# EAGLE design Arduino-M0-Mod4 (EAGLE 7.5.0)

## Sheet 1 of 2
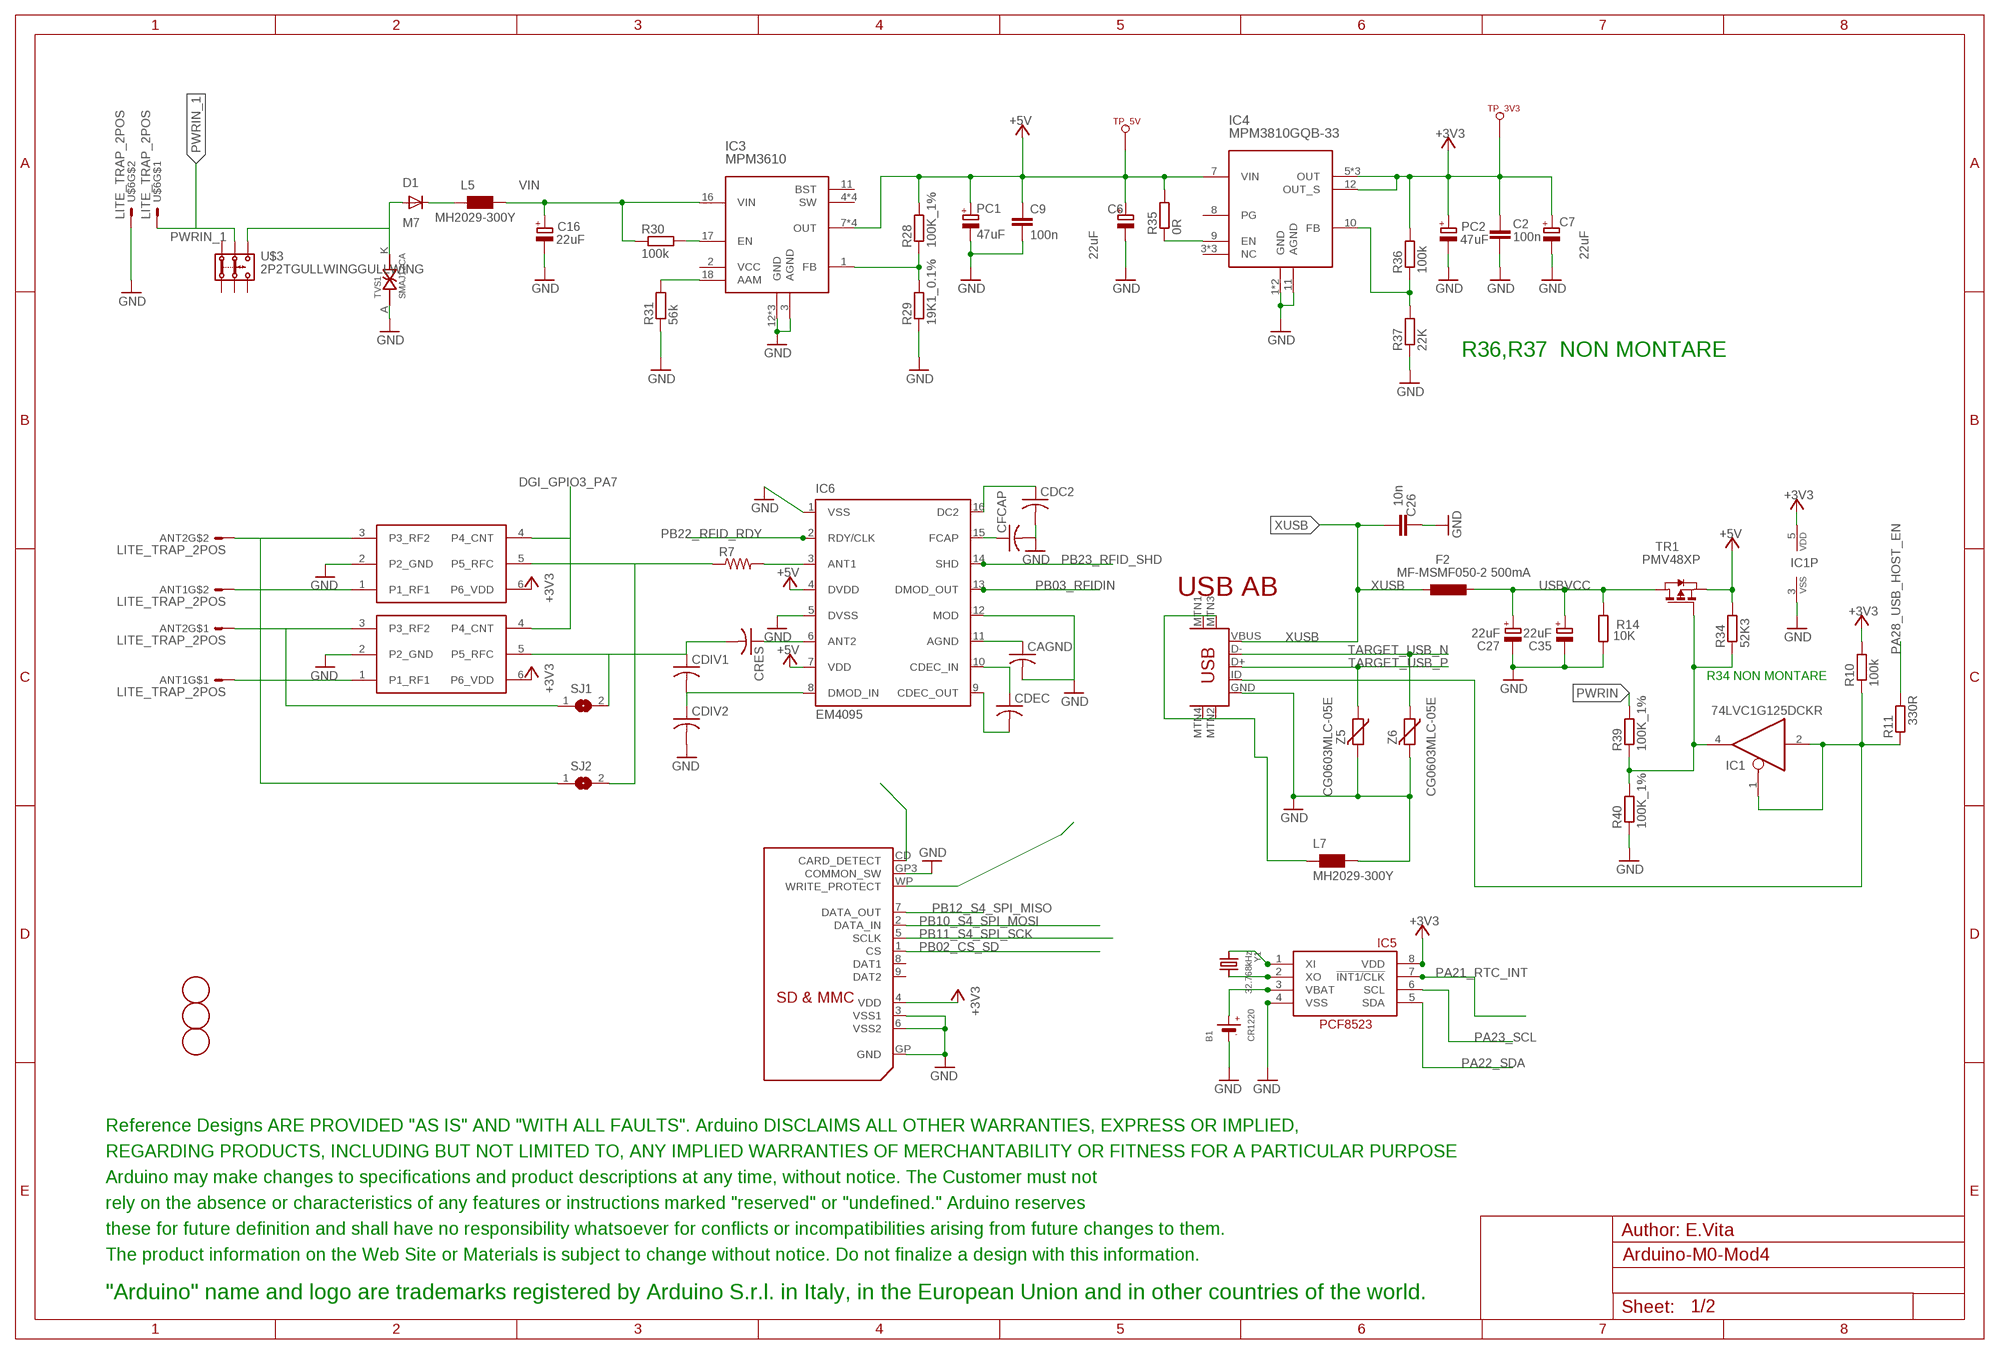
[diagram p0: schematic, sheet 1]

### Parts
ANT1  LITE_TRAP_2POS  [LITE_TRAP_MINI]
ANT2  LITE_TRAP_2POS  [LITE_TRAP_MINI]
B1  CR1220  BATTERYCR1220_SMT  [CR1220]
C2  100n  0015_100NF_0603  [C0603-ROUND]
C6  22uF  0167_  [SMC_B]
C7  22uF  0167_  [SMC_B]
C9  100n  0015_100NF_0603  [C0603-ROUND]
C16  22uF  0167_  [SMC_B]
C26  10n  0142_10NF_0603  [C0603-ROUND]
C27  22uF  0167_  [SMC_B]
C35  22uF  0167_  [SMC_B]
CAGND  C-US  [C0603-ROUND]
CDC2  C-US  [C0603-ROUND]
CDEC  C-US  [C0603-ROUND]
CDIV1  C-USC1206K  [C1206K]
CDIV2  C-USC1206K  [C1206K]
CFCAP  C-US  [C0603-ROUND]
CRES  C-USC1206K  [C1206K]
D1  M7  0020_M7  [SMB]
F2  MF-MSMF050-2 500mA  0002_MF-MSMF050-2  [L1812]
FD1  FIDUCIALMOUNT  [FIDUCIA-MOUNT]
FD2  FIDUCIALMOUNT  [FIDUCIA-MOUNT]
FD3  FIDUCIALMOUNT  [FIDUCIA-MOUNT]
IC1  74LVC1G125DCKR  0040_SN74LVC1G125DCKR  [SC70-5]
IC3  MPM3610  2093_MPM3610GQV-P  [QFN-20]
IC4  MPM3810GQB-33  2068_MPM3810GQB-33  [QFN-12]
IC5  RTC_PCF8523T  [SOIC8_150MIL]
IC6  EM4095  [SO16]
L5  MH2029-300Y  0001_BLM21PG300SN1D_/_MH2029-300Y  [0805]
L7  MH2029-300Y  0001_BLM21PG300SN1D_/_MH2029-300Y  [0805]
PC1  47uF  0113_47UF  [PANASONIC_D]
PC2  47uF  0113_47UF  [PANASONIC_D]
R7  R-US_R1206  [R1206]
R10  100k  0026_100K_0603  [R0603-ROUND]
R11  330R  0049_330R_0603  [R0603-ROUND]
R14  10K  0028_CR0603JW103L  [R0603-ROUND]
R28  100K_1%  2022_CR0603FW104L  [R0603-ROUND]
R29  19K1_0.1%  2339_  [R0603-ROUND]
R30  100k  0026_100K_0603  [R0603-ROUND]
R31  56k  0411_56K_0603  [R0603-ROUND]
R34  52K3  0180_52K3_0603  [R0603-ROUND]
R35  0R  0233_0R_0603  [R0603-ROUND]
R36  100k  0026_100K_0603  [R0603-ROUND]
R37  22K  0194_  [R0603-ROUND]
R39  100K_1%  2022_CR0603FW104L  [R0603-ROUND]
R40  100K_1%  2022_CR0603FW104L  [R0603-ROUND]
SJ1  SJW  [SJW]
SJ2  SJW  [SJW]
TP_3V3  TP_SP  [TP-SP]
TP_5V  TP_SP  [TP-SP]
TR1  PMV48XP  0297_PMV48XP  [SOT-23]
TVS1  SMAJ12CA  2194_SMAJ12CA  [SMA-TVS]
U$1  DISCLAIMER-SMALL  [DISCLAIMER]
U$3  2P2TGULLWINGGULLWING  [GULL_WING]
U$4  SDMMC06132  [06132]
U$5  USB-MINIB-5PIN  [USB-MINIB]
U$6  LITE_TRAP_2POS  [LITE_TRAP_MINI]
U$7  PE4259_RF_SWITCH  [SOT363_PHILIPS]
U$8  PE4259_RF_SWITCH  [SOT363_PHILIPS]
Y1  32.768kHz  CRYSTAL8.0X3.8  [CRYSTAL_8X3.8]
Z5  CG0603MLC-05E  0010_BRNCG0603MLC-05E  [CT/CN0603]
Z6  CG0603MLC-05E  0010_BRNCG0603MLC-05E  [CT/CN0603]

### Nets
2GND [gnd]: L7.1 U$5.MTN1(MTN2) U$5.MTN2(MTN3) U$5.MTN3(MTN1) U$5.MTN4
+3V3: C2.2 C7.+ IC1.5(VDD) IC4.5(OUT) IC4.6(OUT) IC4.12(OUT_S) IC4.14(OUT) IC5.8(VDD) PC2.+ R10.2 R36.2 TP_3V3.X(TESTP) U$4.4(VDD) U$7.6(P6_VDD) U$8.6(P6_VDD) ; also sheet 2
+5V [usbvcc]: C6.+ C9.1 IC3.7(OUT) IC3.8(OUT) IC3.9(OUT) IC3.20(OUT) IC4.7(VIN) IC6.4(DVDD) IC6.7(VDD) PC1.+ R28.2 R34.2 R35.2 TP_5V.X(TESTP) TR1.2(S) ; also sheet 2
DGI_GPIO3_PA7: U$7.4(P4_CNT) U$8.4(P4_CNT) ; also sheet 2
GND [gnd]: B1.- C2.1 C6.- C7.- C9.2 C16.- C26.2 C27.- C35.- CAGND.2 CDC2.2 CDIV2.2 CFCAP.2 IC1.3(VSS) IC3.3(AGND) IC3.12(GND) IC3.13(GND) IC3.14(GND) IC4.1(GND) IC4.2(GND) IC4.11(AGND) IC5.4(VSS) IC6.1(VSS) IC6.5(DVSS) IC6.12(MOD) L7.2 PC1.- PC2.- R14.1 R29.1 R31.1 R37.1 R40.1 TVS1.A(AK) U$4.3(VSS1) U$4.6(VSS2) U$4.GP3(COMMON_SW) U$4.GP(GND) U$5.GND U$6.P$3 U$6.P$4 U$7.2(P2_GND) U$8.2(P2_GND) Z5.2 Z6.2 ; also sheet 2
N$2: IC5.2(XO) Y1.P$4
N$3: IC5.1(XI) Y1.P$1
N$4: CFCAP.1 IC6.15(FCAP)
N$5: CAGND.1 IC6.11(AGND)
N$6: IC1.4(O) R34.1 R39.1 R40.2 TR1.3(G)
N$7: IC1.1(OE) IC1.2(I) R10.1 R11.1 U$5.ID
N$8: D1.C L5.1
N$9: IC4.9(EN) R35.1
N$11: IC4.10(FB) R36.1 R37.2
N$12: CRES.1 IC6.6(ANT2)
N$13: CDIV1.2 CDIV2.1 IC6.8(DMOD_IN)
N$14: ANT2.P$3 ANT2.P$4 SJ2.1 U$7.3(P3_RF2)
N$16: CDIV1.1 CRES.2 SJ1.2 U$8.5(P5_RFC)
N$17: CDC2.1 IC6.16(DC2)
N$18: CDEC.2 IC6.9(CDEC_OUT)
N$19: CDEC.1 IC6.10(CDEC_IN)
N$20: IC6.3(ANT1) R7.2
N$21: ANT2.P$1 ANT2.P$2 SJ1.1 U$8.3(P3_RF2)
N$22: R7.1 SJ2.2 U$7.5(P5_RFC)
N$24: ANT1.P$1 ANT1.P$2 U$8.1(P1_RF1)
N$25: ANT1.P$3 ANT1.P$4 U$7.1(P1_RF1)
N$26: IC3.1(FB) R28.1 R29.2
N$28: IC3.17(EN) R30.2
N$29: IC3.18(AAM) R31.2
PA21_RTC_INT: IC5.7(!INT1/CLK) ; also sheet 2
PA22_SDA: IC5.5(SDA) ; also sheet 2
PA23_SCL: IC5.6(SCL) ; also sheet 2
PA28_USB_HOST_EN: R11.2 ; also sheet 2
PB02_CS_SD: U$4.1(CS) ; also sheet 2
PB03_RFIDIN: IC6.13(DMOD_OUT) ; also sheet 2
PB10_S4_SPI_MOSI: U$4.2(DATA_IN) ; also sheet 2
PB11_S4_SPI_SCK: U$4.5(SCLK) ; also sheet 2
PB12_S4_SPI_MISO: U$4.7(DATA_OUT) ; also sheet 2
PB22_RFID_RDY: IC6.2(RDY/CLK) ; also sheet 2
PB23_RFID_SHD: IC6.14(SHD) ; also sheet 2
PWRIN [USB]: D1.A R39.2 TVS1.K(KA) U$3.P$5(3.1) ; also sheet 2
PWRIN_1 [USB]: U$3.P$3(2.1) U$6.P$1 U$6.P$2
SD_CD: U$4.CD(CARD_DETECT)
SD_WP: U$4.WP(WRITE_PROTECT)
TARGET_USB_N [USBpair]: U$5.D- Z6.1 ; also sheet 2
TARGET_USB_P [USBpair]: U$5.D+ Z5.1 ; also sheet 2
USBVCC [usbvcc]: C27.+ C35.+ F2.1 R14.2 TR1.1(D)
VBAT1: B1.+$1(+) IC5.3(VBAT)
VIN [gnd]: C16.+ IC3.16(VIN) L5.2 R30.1
XUSB [usbvcc]: C26.1 F2.2 U$5.VBUS
Unconnected: IC3.2(VCC) IC3.4(SW) IC3.5(SW) IC3.6(SW) IC3.11(BST) IC3.19(SW) IC4.3(NC) IC4.4(NC) IC4.8(PG) IC4.13(NC) U$3.P$1(1.1) U$3.P$2(1.2) U$3.P$4(2.2) U$3.P$6(3.2) U$4.8(DAT1) U$4.9(DAT2)

### Notes on the sheet
- R36,R37  NON MONTARE
- USB AB
- R34 NON MONTARE
- Author: E.Vita

## Sheet 2 of 2
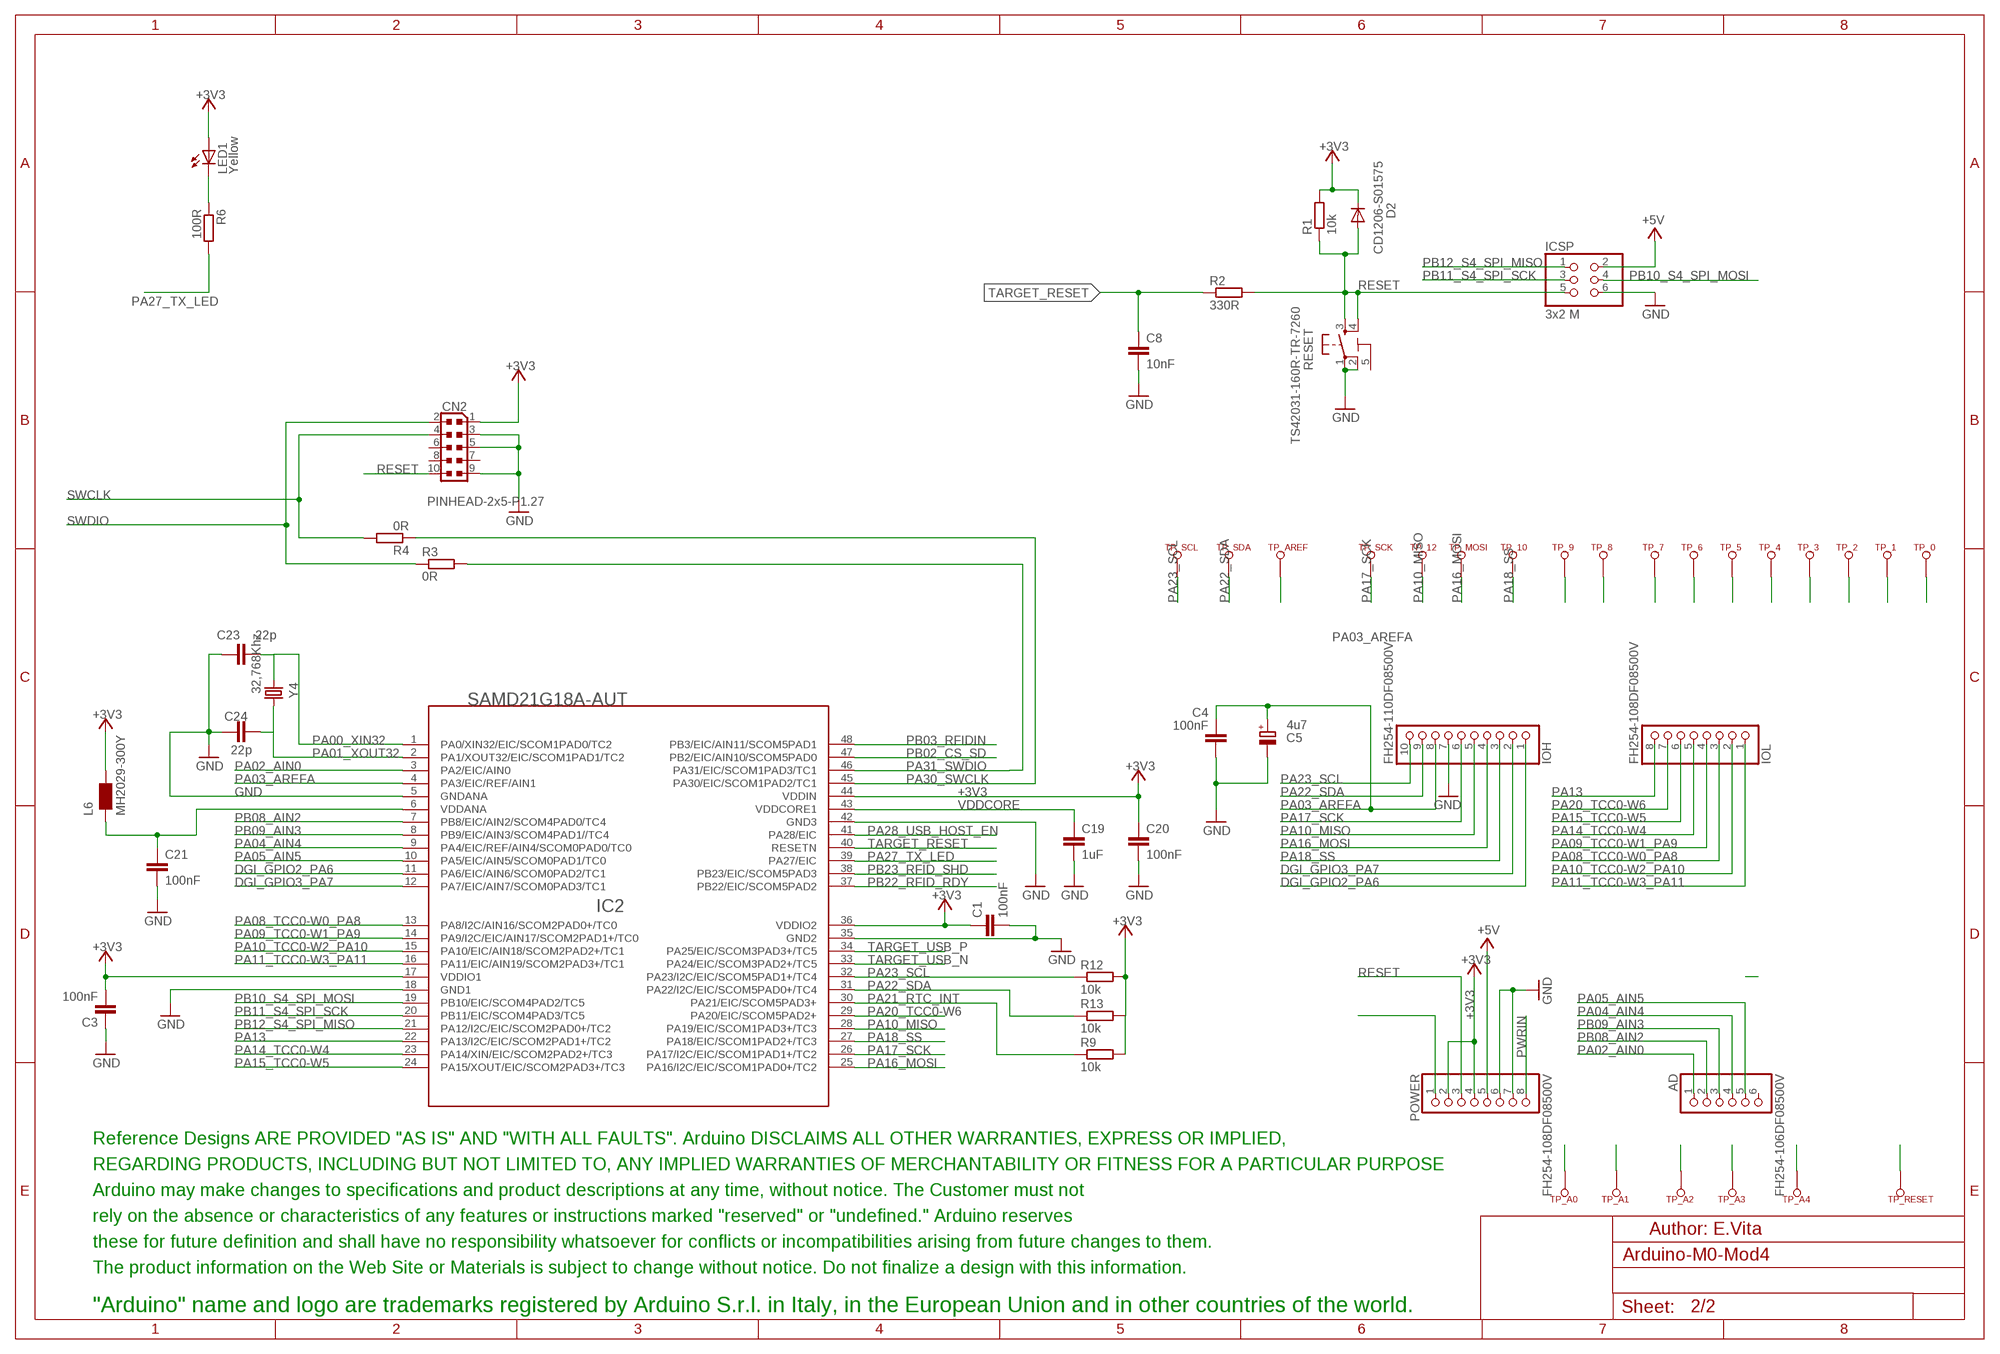
[diagram p1: schematic, sheet 2]

### Parts
AD  FH254-106DF08500V  1682_20TW-535_STD  [1X06]
C1  100nF  0015_100NF_0603  [C0603-ROUND]
C3  100nF  0015_100NF_0603  [C0603-ROUND]
C4  100nF  0015_100NF_0603  [C0603-ROUND]
C5  4u7  0474_TAJA475M016RNJ  [SMC_A]
C8  10nF  0142_10NF_0603  [C0603-ROUND]
C19  1uF  0006_1UF_0603/GRM188R61E105KA12D  [C0603-ROUND]
C20  100nF  0015_100NF_0603  [C0603-ROUND]
C21  100nF  0015_100NF_0603  [C0603-ROUND]
C23  22p  0014_22PF_0603  [C0603-ROUND]
C24  22p  0014_22PF_0603  [C0603-ROUND]
CN2  PINHEAD-2x5-P1.27  0171_PH127-205DF055G00AROUND-PADS  [PINHEAD_2X05_127]
D2  CD1206-S01575  0012_CD1206-S01575  [MINIMELF]
IC2  SAMD21G18A-AUT  1792_SAMD21G18A-AUT  [TQFP48-7X7]
ICSP  3x2 M  0114_PH254-203DF118A00V  [2X03]
IOH  FH254-110DF08500V  1684_20TW-537  [1X10]
IOL  FH254-108DF08500V  1683_20TW-536  [1X08]
L6  MH2029-300Y  0001_BLM21PG300SN1D_/_MH2029-300Y  [0805]
LED1  Yellow  0044_KPT-2012YC  [CHIPLED_0805]
POWER  FH254-108DF08500V  1683_20TW-536  [1X08]
R1  10k  0028_CR0603JW103L  [R0603-ROUND]
R2  330R  0049_330R_0603  [R0603-ROUND]
R3  0R  0233_0R_0603  [R0603-ROUND]
R4  0R  0233_0R_0603  [R0603-ROUND]
R6  100R  0233_0R_0603  [R0603-ROUND]
R9  10k  0028_CR0603JW103L  [R0603-ROUND]
R12  10k  0028_CR0603JW103L  [R0603-ROUND]
R13  10k  0028_CR0603JW103L  [R0603-ROUND]
RESET  TS42031-160R-TR-7260  0946_TS42031-160W-TR-7260  [TS42]
TP_0  TP_SP  [TP-SP]
TP_1  TP_SP  [TP-SP]
TP_2  TP_SP  [TP-SP]
TP_3  TP_SP  [TP-SP]
TP_4  TP_SP  [TP-SP]
TP_5  TP_SP  [TP-SP]
TP_6  TP_SP  [TP-SP]
TP_7  TP_SP  [TP-SP]
TP_8  TP_SP  [TP-SP]
TP_9  TP_SP  [TP-SP]
TP_10  TP_SP  [TP-SP]
TP_12  TP_SP  [TP-SP]
TP_A0  TP_SP  [TP-SP]
TP_A1  TP_SP  [TP-SP]
TP_A2  TP_SP  [TP-SP]
TP_A3  TP_SP  [TP-SP]
TP_A4  TP_SP  [TP-SP]
TP_AREF  TP_SP  [TP-SP]
TP_MOSI  TP_SP  [TP-SP]
TP_RESET  TP_SP  [TP-SP]
TP_SCK  TP_SP  [TP-SP]
TP_SCL  TP_SP  [TP-SP]
TP_SDA  TP_SP  [TP-SP]
U$2  DISCLAIMER-SMALL  [DISCLAIMER]
Y4  32,768Khz  0213_ABS07-32.768KHZ-T  [RESONATOR_EPSON_FC_145]

### Nets
+3V3: C1.1 C3.2 C20.1 CN2.1 D2.C IC2.17(VDDIO1) IC2.36(VDDIO2) IC2.44(VDDIN) L6.2 LED1.A POWER.2 POWER.4 R1.2 R9.2 R12.2 R13.2 ; also sheet 1
+5V [usbvcc]: ICSP.2 POWER.5 ; also sheet 1
DGI_GPIO1: TP_7.X(TESTP)
DGI_GPIO2_PA6: IC2.11(PA6/EIC/AIN6/SCOM0PAD2/TC1) IOH.1 TP_8.X(TESTP)
DGI_GPIO3_PA7: IC2.12(PA7/EIC/AIN7/SCOM0PAD3/TC1) IOH.2 TP_9.X(TESTP) ; also sheet 1
GND [gnd]: C1.2 C3.1 C4.2 C5.- C8.2 C19.2 C20.2 C21.2 C23.1 C24.1 CN2.3 CN2.5 CN2.9 IC2.5(GNDANA) IC2.18(GND1) IC2.35(GND2) IC2.42(GND3) ICSP.6 IOH.7 POWER.6 POWER.7 RESET.1 RESET.2 ; also sheet 1
N$1: LED1.C R6.1
N$10: C21.1 IC2.6(VDDANA) L6.1
N$56: POWER.1
PA00_XIN32: C23.2 IC2.1(PA0/XIN32/EIC/SCOM1PAD0/TC2) Y4.P$1
PA01_XOUT32: C24.2 IC2.2(PA1/XOUT32/EIC/SCOM1PAD1/TC2) Y4.P$2
PA02_AIN0: AD.1 IC2.3(PA2/EIC/AIN0) TP_A0.X(TESTP)
PA03_AREFA: C4.1 C5.+ IC2.4(PA3/EIC/REF/AIN1) IOH.8 TP_AREF.X(TESTP)
PA04_AIN4: AD.4 IC2.9(PA4/EIC/REF/AIN4/SCOM0PAD0/TC0) TP_A3.X(TESTP)
PA05_AIN5: AD.5 IC2.10(PA5/EIC/AIN5/SCOM0PAD1/TC0) TP_A4.X(TESTP)
PA08_TCC0-W0_PA8: IC2.13(PA8/I2C/AIN16/SCOM2PAD0+/TC0) IOL.3 TP_2.X(TESTP)
PA09_TCC0-W1_PA9: IC2.14(PA9/I2C/EIC/AIN17/SCOM2PAD1+/TC0) IOL.4 TP_3.X(TESTP)
PA10_MISO: IC2.28(PA19/EIC/SCOM1PAD3+/TC3) IOH.5 TP_12.X(TESTP)
PA10_TCC0-W2_PA10: IC2.15(PA10/EIC/AIN18/SCOM2PAD2+/TC1) IOL.2 TP_1.X(TESTP)
PA11_TCC0-W3_PA11: IC2.16(PA11/EIC/AIN19/SCOM2PAD3+/TC1) IOL.1 TP_0.X(TESTP)
PA13: IC2.22(PA13/I2C/EIC/SCOM2PAD1+/TC2) IOL.8
PA14_TCC0-W4: IC2.23(PA14/XIN/EIC/SCOM2PAD2+/TC3) IOL.5 TP_4.X(TESTP)
PA15_TCC0-W5: IC2.24(PA15/XOUT/EIC/SCOM2PAD3+/TC3) IOL.6 TP_5.X(TESTP)
PA16_MOSI: IC2.25(PA16/I2C/EIC/SCOM1PAD0+/TC2) IOH.4 TP_MOSI.X(TESTP)
PA17_SCK: IC2.26(PA17/I2C/EIC/SCOM1PAD1+/TC2) IOH.6 TP_SCK.X(TESTP)
PA18_SS: IC2.27(PA18/EIC/SCOM1PAD2+/TC3) IOH.3 TP_10.X(TESTP)
PA20_TCC0-W6: IC2.29(PA20/EIC/SCOM5PAD2+) IOL.7 TP_6.X(TESTP)
PA21_RTC_INT: IC2.30(PA21/EIC/SCOM5PAD3+) R9.1 ; also sheet 1
PA22_SDA: IC2.31(PA22/I2C/EIC/SCOM5PAD0+/TC4) IOH.9 R13.1 TP_SDA.X(TESTP) ; also sheet 1
PA23_SCL: IC2.32(PA23/I2C/EIC/SCOM5PAD1+/TC4) IOH.10 R12.1 TP_SCL.X(TESTP) ; also sheet 1
PA27_TX_LED: IC2.39(PA27/EIC) R6.2
PA28_USB_HOST_EN: IC2.41(PA28/EIC) ; also sheet 1
PA30_SWCLK: IC2.45(PA30/EIC/SCOM1PAD2/TC1) R4.1
PA31_SWDIO: IC2.46(PA31/EIC/SCOM1PAD3/TC1) R3.2
PB02_CS_SD: IC2.47(PB2/EIC/AIN10/SCOM5PAD0) ; also sheet 1
PB03_RFIDIN: IC2.48(PB3/EIC/AIN11/SCOM5PAD1) ; also sheet 1
PB08_AIN2: AD.2 IC2.7(PB8/EIC/AIN2/SCOM4PAD0/TC4) TP_A1.X(TESTP)
PB09_AIN3: AD.3 IC2.8(PB9/EIC/AIN3/SCOM4PAD1//TC4) TP_A2.X(TESTP)
PB10_S4_SPI_MOSI: IC2.19(PB10/EIC/SCOM4PAD2/TC5) ICSP.4 ; also sheet 1
PB11_S4_SPI_SCK: IC2.20(PB11/EIC/SCOM4PAD3/TC5) ICSP.3 ; also sheet 1
PB12_S4_SPI_MISO: IC2.21(PA12/I2C/EIC/SCOM2PAD0+/TC2) ICSP.1 ; also sheet 1
PB22_RFID_RDY: IC2.37(PB22/EIC/SCOM5PAD2) ; also sheet 1
PB23_RFID_SHD: IC2.38(PB23/EIC/SCOM5PAD3) ; also sheet 1
PWRIN [USB]: POWER.8 ; also sheet 1
RESET: CN2.10 D2.A ICSP.5 POWER.3 R1.1 R2.2 RESET.3 RESET.4 TP_RESET.X(TESTP)
SWCLK: CN2.4 R4.2
SWDIO: CN2.2 R3.1
TARGET_RESET: C8.1 IC2.40(RESETN) R2.1
TARGET_USB_N [USBpair]: IC2.33(PA24/EIC/SCOM3PAD2+/TC5) ; also sheet 1
TARGET_USB_P [USBpair]: IC2.34(PA25/EIC/SCOM3PAD3+/TC5) ; also sheet 1
VDDCORE: C19.1 IC2.43(VDDCORE1)
Unconnected: AD.6 CN2.6 CN2.7 CN2.8

### Notes on the sheet
- Author: E.Vita

## Power pins joined to a net without a drawn wire
5-GND: RESET.5(5-GND)

## Library data of the parts
AD = Connettori:1682_20TW-535: Female Gray Connector strip for Arduino 3V3 bases - 6x1 F V h 8,5 p2,54; MONTHLY_USAGE: 86722.85; PART_NUMBER: 20TW-535; PRICE: _0.03; SUPPLIER: CBC_elettronica__s.r.l.; TYPE: Connettori
ANT1 ANT2 U$6 = con-molex:LITE_TRAP_2POS
B1 = microbuilder:BATTERY: CR1220 SMT - Digikey: 3001K-ND CD2032 BAT-HLD-001 - Digikey: BAT-HLD-001-ND
C1 C3 C4 C20 C21 = Condensatori:0015_100NF_0603: 100nF 0603 50V; CASE: 0603; MONTHLY_USAGE: _____; PART_NUMBER: cl10b104kbnc; PRICE: _____; SUPPLIER: _____; TYPE: Condensatori
C2 C9 = Condensatori:0015_100NF_0603: 100nF 0603 50V; CASE: 0603; MONTHLY_USAGE: _____; PART_NUMBER: cl10b104kbnc; PRICE: _____; SUPPLIER: _____; TYPE: Condensatori; VALUE: 100nF
C5 = Condensatori:0474_TAJA475M016RNJ: 4u7 tantalio Case A - testa gialla -Tantalio; CASE: CaseA_(1206); MONTHLY_USAGE: _____; PART_NUMBER: TAJA475M016RNJ; PRICE: _____; SUPPLIER: _____; TYPE: Condensatori
C6 C7 C16 C27 C35 = Condensatori:0167_: 22uF 25V; MONTHLY_USAGE: _____; PRICE: _____; SUPPLIER: _____; TYPE: Condensatori
C8 = Condensatori:0142_10NF_0603: 10nF 0603; CASE: 0603; MONTHLY_USAGE: _____; PART_NUMBER: 10nF_0603; PRICE: _____; SUPPLIER: _____; TYPE: Condensatori
C19 = Condensatori:0006_1UF_0603/GRM188R61E105KA12D: 1uF 0603; CASE: 0603; MONTHLY_USAGE: _____; PART_NUMBER: 1uF_0603/GRM188R61E105KA12D; PRICE: _____; SUPPLIER: _____; TYPE: Condensatori
C23 C24 = Condensatori:0014_22PF_0603: 22pF 0603; CASE: 0603; MONTHLY_USAGE: _____; PART_NUMBER: 22pF_0603; PRICE: _____; SUPPLIER: _____; TYPE: Condensatori
C26 = Condensatori:0142_10NF_0603: 10nF 0603; CASE: 0603; MONTHLY_USAGE: _____; PART_NUMBER: 10nF_0603; PRICE: _____; SUPPLIER: _____; TYPE: Condensatori; VALUE: 10nF
CAGND CDC2 CDEC CDIV1 CDIV2 CFCAP CRES = rcl:C-US: CAPACITOR, American symbol
CN2 = Connettori:0171_PH127-205DF055G00A: 2x5 PASSO 1,27
D1 = Diodi:0020_M7: 1.0A 40V SURFACE MOUNT GLASS PASSIVATED RECTIFIER M7; CASE: SMA; MONTHLY_USAGE: _____; PART_NUMBER: M7; PRICE: _____; SUPPLIER: _____; TYPE: Diodi
D2 = Diodi:0012_CD1206-S01575: small-signal high-speed Switching Diodes CD1206; CASE: 1206; MONTHLY_USAGE: _____; PART_NUMBER: CD1206-S01575; PRICE: _____; SUPPLIER: _____; TYPE: Diodi
F2 = Protezione:0002_MF-MSMF050-2: 500 mA Multifuse � Polyfuse; MONTHLY_USAGE: _____; PART_NUMBER: MF-MSMF050-2; PRICE: _____; SUPPLIER: _____; TYPE: Protezione
FD1-FD3 = SmartPrj:FIDUCIALMOUNT
IC1 = IntegratedCircuits:0040_SN74LVC1G125DCKR: Single bus buffer with 3-state output; CASE: SC70; MONTHLY_USAGE: _____; PART_NUMBER: SN74LVC1G125DCKR; PRICE: _____; SUPPLIER: _____; TYPE: Circuito_Integrato
IC2 = IntegratedCircuits:1792_SAMD21G18A-AUT: Atmel D21 32bit ARM Cortex-M0 microcontroller - 48 PIN TQFP 256KB flash memory + 32KB SRAM
IC3 = IntegratedCircuits:2093_MPM3610GQV-P: MPM3610 Step Down Regulator; CASE: QFN-20; PART_NUMBER: MPM3610GQV-P; TYPE: Circuito_Integrato
IC4 = IntegratedCircuits:2068_MPM3810GQB-33: MPM3810 6V Input, 1.2A Module Synchronous Step-Down Converter with Integrated Inductor; PART_NUMBER: MPM3810GQB-33
IC5 = microbuilder:RTC_PCF8523
IC6 = em-microelectronic:EM4095: Read/Write analog front end for 125kHz RFID Basestation Source: http://www.emmicroelectronic.com/webfiles/Product/RFID/DS/EM4095_DS.pdf
ICSP = Connettori:0114_PH254-203DF118A00V: 3x2 M V h 8,5 mm p2,54; MONTHLY_USAGE: _____; PART_NUMBER: PH254-203DF118A00V; PRICE: _____; SUPPLIER: _____; TYPE: Connettori; VALUE: ICSP
IOH = Connettori:1684_20TW-537: Female Gray Connector strip for Arduino 3V3 bases - 10x1 F V h 8,5 p2,54mm; MONTHLY_USAGE: _____; PART_NUMBER: 20TW-537; PRICE: _____; SUPPLIER: _____; TYPE: Connettori
IOL POWER = Connettori:1683_20TW-536: Female Gray Connector strip for Arduino 3V3 bases - 8x1 F V h 8,5 p2,54mm; MONTHLY_USAGE: _____; PART_NUMBER: 20TW-536; PRICE: _____; SUPPLIER: _____; TYPE: Connettori
L5-L7 = Protezione:0001_BLM21PG300SN1D_/_MH2029-300Y: BLM21; MONTHLY_USAGE: _____; PART_NUMBER: BLM21PG300SN1D_/_MH2029-300Y; PRICE: _____; SUPPLIER: _____; TYPE: Protezione
LED1 = Opto:0044_KPT-2012YC: LED YELLOW - SMD - 0805; MONTHLY_USAGE: _____; PART_NUMBER: KPT-2012YC; PRICE: _____; SUPPLIER: _____; TYPE: Opto
PC1 PC2 = Condensatori:0113_47UF: 47uF; MONTHLY_USAGE: _____; PART_NUMBER: 47uF; PRICE: _____; SUPPLIER: _____; TYPE: Condensatori
R1 R9 R12 R13 = Resistenze:0028_CR0603JW103L: 10K 0603; CASE: 0603; MONTHLY_USAGE: _____; PART_NUMBER: CR0603JW103L; PRICE: _____; SUPPLIER: _____; TYPE: Resistenze
R2 R11 = Resistenze:0049_330R_0603: 330R 0603; CASE: 0603; MONTHLY_USAGE: _____; PART_NUMBER: 330R_0603; PRICE: _____; SUPPLIER: _____; TYPE: Resistenze
R3 R4 R35 = Resistenze:0233_0R_0603: 0R 0603; CASE: 0603; MONTHLY_USAGE: _____; PART_NUMBER: 0R_0603; PRICE: _____; SUPPLIER: _____; TYPE: Resistenze
R6 = Resistenze:0233_0R_0603: 0R 0603; CASE: 0603; MONTHLY_USAGE: _____; PART_NUMBER: 0R_0603; PRICE: _____; SUPPLIER: _____; TYPE: Resistenze; VALUE: 0R
R7 = rcl:R-US_: RESISTOR, American symbol
R10 R30 R36 = Resistenze:0026_100K_0603: 100K 0603; CASE: 0603; MONTHLY_USAGE: _____; PART_NUMBER: 100K_0603; PRICE: _____; SUPPLIER: _____; TYPE: Resistenze
R14 = Resistenze:0028_CR0603JW103L: 10K 0603; CASE: 0603; MONTHLY_USAGE: _____; PART_NUMBER: CR0603JW103L; PRICE: _____; SUPPLIER: _____; TYPE: Resistenze; VALUE: 10k
R28 R39 R40 = Resistenze:2022_CR0603FW104L: 0603 Resistor 100K 1%; PART_NUMBER: CR0603FW104L
R29 = Resistenze:2339_: 19K1 0,1% 0603; CASE: 0603; MONTHLY_USAGE: _____; PRICE: _____; SUPPLIER: _____; TYPE: Resistenze; VALUE: 19K1_0,1%
R31 = Resistenze:0411_56K_0603: 56K 0603; CASE: 0603; MONTHLY_USAGE: _____; PART_NUMBER: 56K_0603; PRICE: _____; SUPPLIER: _____; TYPE: Resistenze
R34 = Resistenze:0180_52K3_0603: 52k3 0603; CASE: 0603; MONTHLY_USAGE: _____; PART_NUMBER: 52k3_0603; PRICE: _____; SUPPLIER: _____; TYPE: Resistenze; VALUE: 52k3
R37 = Resistenze:0194_: 22K 0603; CASE: 0603; MONTHLY_USAGE: _____; PRICE: _____; SUPPLIER: _____; TYPE: Resistenze; VALUE: 22K_1%
RESET = Switches:0946_TS42031-160W-TR-7260: Pushbutton 6x6 Smd - White; MONTHLY_USAGE: _____; PART_NUMBER: IT-1157AHNP-160G-G_GTR; PRICE: _____; SUPPLIER: _____; TYPE: Switches; VALUE: TS42
SJ1 SJ2 = jumper:SJ: SMD solder JUMPER
TP_0 TP_1-TP_3 TP_3V3 TP_4 TP_5 TP_5V TP_6-TP_10 TP_12 TP_A0 TP_A1-TP_A4 TP_AREF TP_MOSI TP_RESET TP_SCK TP_SCL TP_SDA = SmartPrj:TP_SP
TR1 = Transistors:0297_PMV48XP: 20 V, 3.5 A P-channel Trench MOSFET - PMV48XP; CASE: SOT23; MONTHLY_USAGE: _____; PART_NUMBER: PMV48XP; PRICE: _____; SUPPLIER: _____; TYPE: Transistor
TVS1 = Protezione:2194_SMAJ12CA: TVS Bidirectional 400W 12V, case DO-214AC (SMA); CASE: SMA-TVS; PART_NUMBER: SMAJ12CA; TYPE: Protezione
U$1 U$2 = Misc:DISCLAIMER-SMALL: DISCLAIMER
U$3 = switch:2P2TGULLWING
U$4 = microbuilder:SDMMC: SD MMC Card holder 4UCON part #06132 - easy to solder
U$5 = USB_miniB:USB-MINIB
U$7 U$8 = rf-micro-devices:PE4259_RF_SWITCH
Y1 = microbuilder:CRYSTAL: Crystals HC49UP - Surface Mount Crystal 4.0MHz 18pF +/-30ppm Surface Mount Crystal [Digikey: 535-9857-1-ND] 12.0 MHz Surface Mount Crystal [Digikey: 535-9869-6-ND] 25.0 MHz Surface Mount Crystal [Digikey: 535-9078-1-ND] 2.5 x 2.0mm - MEMs SMT Crystal 16.0 MHz 10pF 20ppm 2.5 x 2.0mm Crystal [Digikey -40-85°C: 535-10923-1-ND] 3.2 x 2.5mm - MEMs SMT Crystal 12.0 MHz 8pF 15ppm 3.2 x 2.5mm Crystal [Digikey: -10-70°C: 644-1047-1-ND -40-125°C: 644-1128-1-ND] 40~85°C cheaper: 644-1173-6-ND 16.0 MHz 8pF 15ppm 3.2 x 2.5mm Crystal [Digikey: -10-70°C: 644-1049-1-ND -40-125°C: 644-1129-2-ND]-40~85°C cheaper: 644-1175-6-ND 16.0 MHz 10pF 10ppm 3.2 x 2.5mm Crystal [Digikey: 644-1100-1-ND] 27.12 MHz 18pF 30ppm 3.2 x 2.5mm Crystal [Digikey: 887-1424-1-ND] 27.12MHz 10pF 10ppm 3.2 x 2.5mm Crystal [Digikey: 887-1329-1-ND] 4.9 x 1.8mm - MEMs SMT Crystal 32.768 KHz 12.5pF 20ppm 4.9 x 1.8mm Crystal [Digikey: SE2415CT-ND] 8.0 x 3.8mm - Surface Mount Crystal 32.768kHz 12.5pF 20ppm -40°C-85°C [Digikey: 535-9166-2-ND] Cylinder 32.768KHz Cylinder Crystal (2x6mm body) [Ex. Digikey: 300-8341-2-ND]
Y4 = Cristalli:0213_ABS07-32.768KHZ-T: 32,768KHz - SMD; MONTHLY_USAGE: _____; PART_NUMBER: ABS07-32.768KHZ-T; PRICE: _____; SUPPLIER: _____; TYPE: Cristalli; VALUE: 32,768Khz_SMD
Z5 Z6 = Protezione:0010_BRNCG0603MLC-05E: CG0603MLC-05E; MONTHLY_USAGE: _____; PART_NUMBER: BRNCG0603MLC-05E; PRICE: _____; SUPPLIER: _____; TYPE: Protezione; VALUE: BRNCG0603MLC-05E

## Net classes
1 USB: width 0.203 mm, drill 0.305 mm, clearance 0.178 mm
2 gnd: width 0.254 mm, drill 0.254 mm, clearance 0.178 mm
3 usbvcc: width 0.203 mm, drill 0.406 mm, clearance 0.178 mm
4 USBpair: width 0.254 mm, drill 0.406 mm, clearance 0.406 mm

## Board
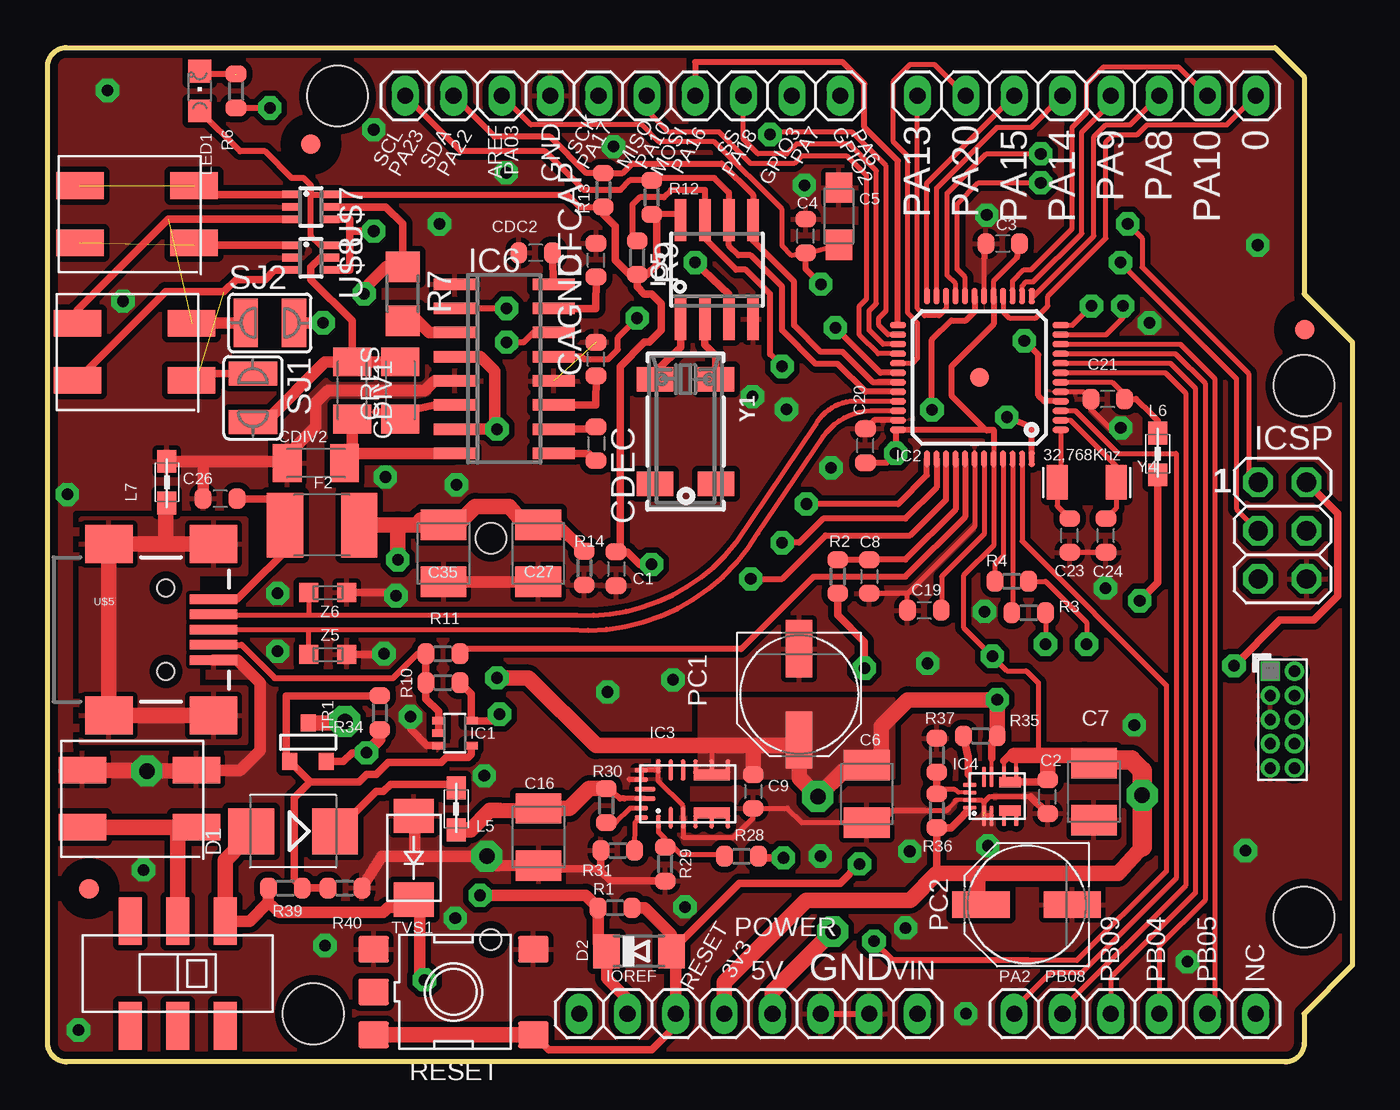
[diagram p2: board, top side]
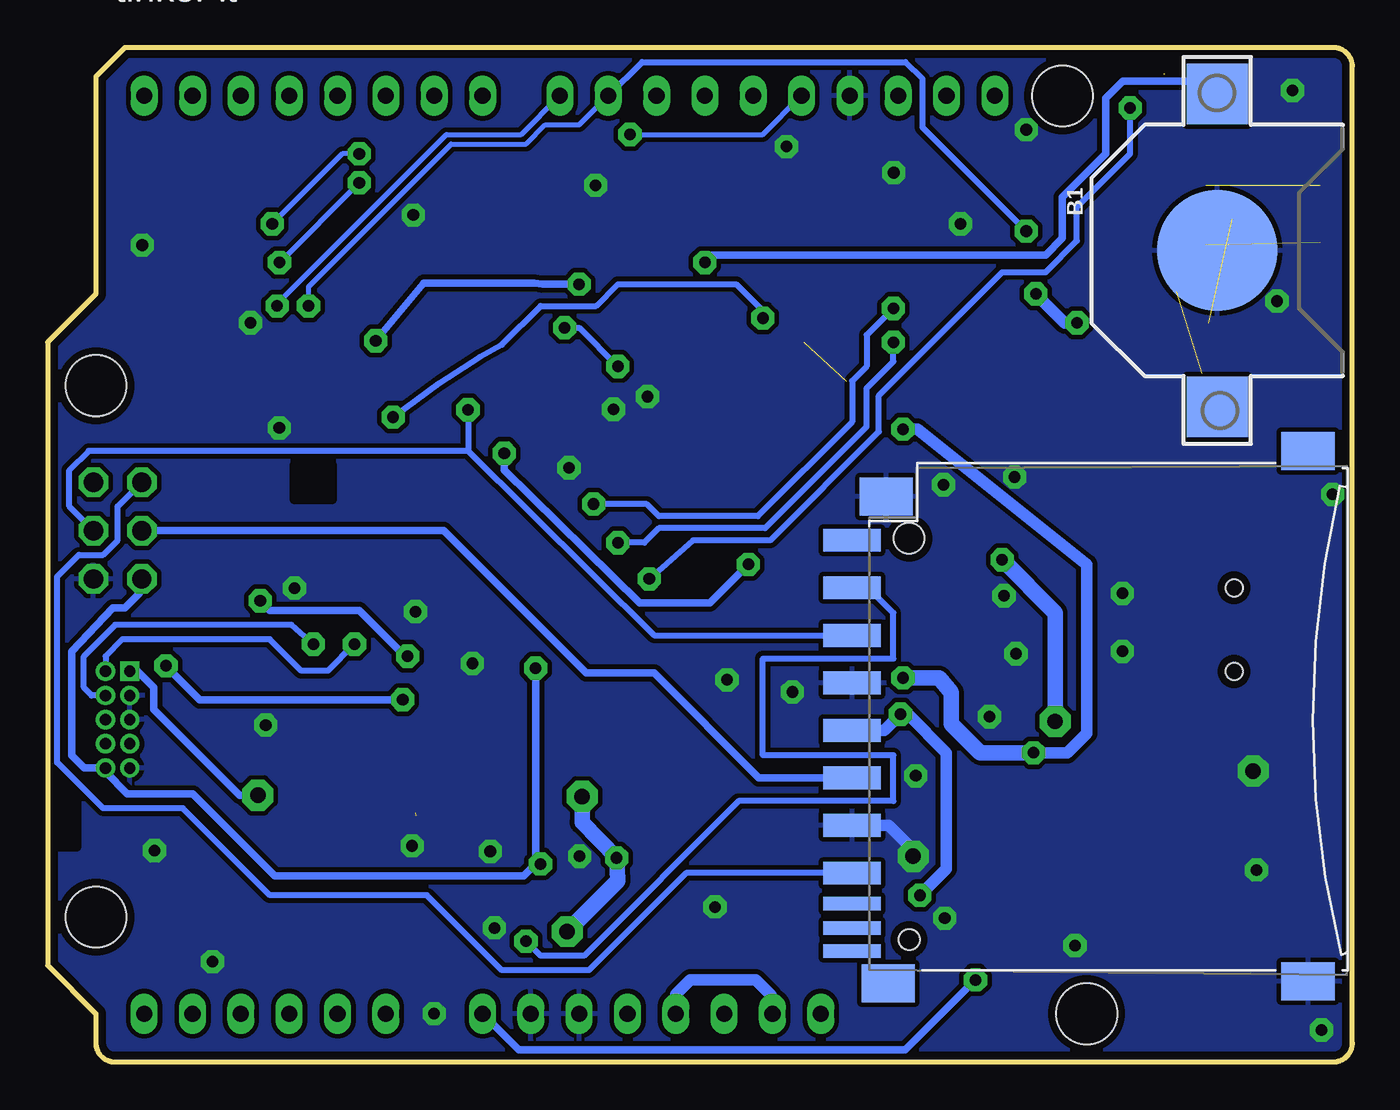
[diagram p3: board, bottom side, seen from below]

Size 68.58 x 53.34 mm. Coordinates in mm from the lower left corner, seen from the top.
Outline: 64.52,53.34 66.04,51.82 66.04,40.39 68.58,37.85 68.58,5.08 66.04,2.54 66.04,1 arc-90 65.04,0 1,0 arc-90 0,1 0,52.34 arc-90 1,53.34 64.52,53.34
Copper layers (1*2+15*16): Top 0.035mm / dielectric 0.5mm / Route2 0.035mm / dielectric 0.4mm / Ground 0.035mm / dielectric 0.5mm / Bottom 0.035mm
Design rules "ArduinoUno *": minimum track width 6mil, minimum drill 16mil, track to track 8mil, track to pad 8mil, pad to pad 4mil, via to via 8mil, smd to smd 4mil, copper to edge 16mil, drill to drill 10mil, minimum pad ring 6mil, minimum via ring 4.5mil, stop-mask expansion 1mil, vias tented up to drill 32mil, thermal gap 10mil
Holes 3.2 mm at 66.04,35.56 66.04,7.62 15.24,50.8 13.97,2.54
bRestrict: area 67.1,11.3 to 68.8,15.6
vRestrict: area 28.4,44.1 to 30.2,49.1; area 28.8,45.5 to 30.5,49.1; area 31.9,45.3 to 33,48.8; area 34.4,45.3 to 35.6,48.8; area 37,45.3 to 38.1,48.8; area 39.5,45.3 to 40.6,48.8; area 42.2,47.2 to 43.3,48.8; area 43.7,45.1 to 51.1,46.9; area 60.3,44.2 to 61.7,46.7; area 62.9,44.2 to 64.3,46.7; area 61.3,35.8 to 64.8,37.2; area 5.7,22.6 to 7.4,30.1; area 47.9,10.3 to 48.5,10.8; area 50.4,10.2 to 50.9,11; area 8.9,19.6 to 10.3,21.8; area 48.3,47.5 to 49.5,48.9; area 47.6,47.4 to 48.8,48.9; area 50.2,47.4 to 51.3,48.9; area 52.8,47.4 to 54,48.9; area 55.2,47.4 to 56.4,48.9; area 57.9,47.4 to 59.1,48.9; area 60.5,47.4 to 61.6,48.9; area 63,47.4 to 64.1,48.9; area 44.7,47.2 to 45.8,48.8

### Footprints (pad centres in the part's own frame; a part is rotated, then mirrored left to right if it is on the bottom)
1X06 = drill 0.85 pad 1.422 long: 1 -6.35,0; 2 -3.81,0; 3 -1.27,0; 4 1.27,0; 5 3.81,0; 6 6.35,0
LITE_TRAP_MINI = smd 2.5 x 1.4: P$1 -3,1.5; P$2 3,1.5; P$3 -3,-1.5; P$4 3,-1.5
CR1220 = smd 3.2 x 3.2: +$1 -8.225,0; +$2 8.225,0 | smd 6.35 x 6.35: - 0,0
C0603-ROUND = smd 0.898 x 1.1: 1 -0.889,0; 2 0.889,0
SMC_A = smd 1.6 x 1.4: + -1.5,0; - 1.5,0
SMC_B = smd 1.6 x 2.4: + -1.5,0; - 1.5,0
C1206K = smd 1.5 x 2: 1 -1.5,0; 2 1.5,0
PINHEAD_2X05_127 = drill 0.6 pad 1.016 square: 1 -0.635,2.54 | drill 0.6 pad 1.016: 2 0.635,2.54; 3 -0.635,1.27; 4 0.635,1.27; 5 -0.635,0; 6 0.635,0; 7 -0.635,-1.27; 8 0.635,-1.27; 9 -0.635,-2.54; 10 0.635,-2.54
SMB = smd 2.4 x 2.4: A 2.2,0; C -2.2,0
MINIMELF = smd 1.4 x 1.8: A 1.7,0; C -1.7,0
L1812 = smd 1.9 x 3.4: 1 -1.95,0; 2 1.95,0
FIDUCIA-MOUNT = smd 1.016 x 1.016: P$1 0,0
SC70-5 = smd 0.4 x 0.7: 1 -0.65,-0.85; 2 0,-0.85; 3 0.65,-0.85; 4 0.65,0.85; 5 -0.65,0.85
TQFP48-7X7 = smd 0.85 x 0.32: 1 -4.275,2.75; 2 -4.275,2.25; 3 -4.275,1.75; 4 -4.275,1.25; 5 -4.275,0.75; 6 -4.275,0.25; 7 -4.275,-0.25; 8 -4.275,-0.75; 9 -4.275,-1.25; 10 -4.275,-1.75; 11 -4.275,-2.25; 12 -4.275,-2.75; 25 4.275,-2.75; 26 4.275,-2.25; 27 4.275,-1.75; 28 4.275,-1.25; 29 4.275,-0.75; 30 4.275,-0.25; 31 4.275,0.25; 32 4.275,0.75; 33 4.275,1.25; 34 4.275,1.75; 35 4.275,2.25; 36 4.275,2.75 | smd 0.32 x 0.85: 13 -2.75,-4.275; 14 -2.25,-4.275; 15 -1.75,-4.275; 16 -1.25,-4.275; 17 -0.75,-4.275; 18 -0.25,-4.275; 19 0.25,-4.275; 20 0.75,-4.275; 21 1.25,-4.275; 22 1.75,-4.275; 23 2.25,-4.275; 24 2.75,-4.275; 37 2.75,4.275; 38 2.25,4.275; 39 1.75,4.275; 40 1.25,4.275; 41 0.75,4.275; 42 0.25,4.275; 43 -0.25,4.275; 44 -0.75,4.275; 45 -1.25,4.275; 46 -1.75,4.275; 47 -2.25,4.275; 48 -2.75,4.275 | smd 1 x 1: P$1 0,0
QFN-20 = smd 0.7 x 0.25: 1 -1.45,1.55; 4 -1.45,-0.4; 5 -1.45,-1.25; 6 -1.45,-2.1; 7 1.45,-2.1; 8 1.45,-1.25; 9 1.45,-0.4; 12 1.45,1.55 | smd 1.1 x 0.25: 2 -1.25,0.9; 3 -1.25,0.25; 10 1.25,0.25; 11 1.25,0.9 | smd 0.25 x 0.7: 13 1.25,2.45; 14 0.75,2.45; 17 -0.75,2.45; 18 -1.25,2.45 | smd 0.25 x 1.1: 15 0.25,2.25; 16 -0.25,2.25 | smd 0.6 x 1.95: 19 -1,-1.25; 20 1,-1.25
QFN-12 = smd 1.05 x 0.2: 1 -1.025,0.7; 2 -1.025,0.3; 3 -1.025,-0.35; 4 -1.025,-1; 5 1.025,-1; 6 1.025,-0.35; 7 1.025,0.3; 8 1.025,0.7 | smd 0.2 x 0.7: 9 0.6,1.45; 10 0.2,1.45; 11 -0.2,1.45; 12 -0.6,1.45 | smd 0.55 x 1.2: 13 -0.75,-0.675; 14 0.75,-0.675
SOIC8_150MIL = smd 0.6 x 2.2: 1 -1.905,-2.6; 2 -0.635,-2.6; 3 0.635,-2.6; 4 1.905,-2.6; 5 1.905,2.6; 6 0.635,2.6; 7 -0.635,2.6; 8 -1.905,2.6
SO16 = smd 0.6 x 2.2: 1 -4.445,-2.6; 2 -3.175,-2.6; 3 -1.905,-2.6; 4 -0.635,-2.6; 5 0.635,-2.6; 6 1.905,-2.6; 7 3.175,-2.6; 8 4.445,-2.6; 9 4.445,2.6; 10 3.175,2.6; 11 1.905,2.6; 12 0.635,2.6; 13 -0.635,2.6; 14 -1.905,2.6; 15 -3.175,2.6; 16 -4.445,2.6
2X03 = drill 1.016 pad 1.55 octagon: 1 -2.54,-1.27; 2 -2.54,1.27; 3 0,-1.27; 4 0,1.27; 5 2.54,-1.27; 6 2.54,1.27
1X10 = drill 0.85 pad 1.422 long: 1 -11.43,0; 2 -8.89,0; 3 -6.35,0; 4 -3.81,0; 5 -1.27,0; 6 1.27,0; 7 3.81,0; 8 6.35,0; 9 8.89,0; 10 11.43,0
1X08 = drill 0.85 pad 1.422 long: 1 -8.89,0; 2 -6.35,0; 3 -3.81,0; 4 -1.27,0; 5 1.27,0; 6 3.81,0; 7 6.35,0; 8 8.89,0
0805 = smd 1.2 x 1: 1 -1.1,0; 2 1.1,0
CHIPLED_0805 = smd 1.2 x 1.2: A 0,-1.05; C 0,1.05
PANASONIC_D = smd 3 x 1.4: + 2.4,0; - -2.4,0
R0603-ROUND = smd 0.898 x 1.1: 1 -0.889,0; 2 0.889,0
R1206 = smd 1.6 x 1.803: 1 -1.422,0; 2 1.422,0
TS42 = smd 1.6 x 1.4: 1 -4.2,2.25; 2 4.2,2.25; 3 -4.2,-2.25; 4 4.2,-2.25; 5 -4.2,0
SJW = smd 1.27 x 2.54: 1 -1.27,0; 2 1.27,0
TP-SP = smd 0.8 x 0.8 bottom: X 0,0
SOT-23 = smd 0.787 x 0.889: 1 0.025,-1.016; 2 -0.94,1.016; 3 0.991,1.016
SMA-TVS = smd 1.8 x 2.1: A -2.2,0; K 2.2,0
GULL_WING = smd 1.2 x 2.5: P$1 -2.5,2.75; P$2 -2.5,-2.75; P$3 0,2.75; P$4 0,-2.75; P$5 2.5,2.75; P$6 2.5,-2.75
06132 = smd 1.2 x 3: 1 6.9,0.9; 2 4.4,0.9; 3 1.9,0.9; 4 -0.6,0.9; 5 -3.1,0.9; 6 -5.6,0.9; 7 -8.1,0.9; 9 9.4,0.9 | smd 0.7 x 3: 8 -9.7,0.9; CD -11,0.9; WP -12.2,0.9 | smd 2 x 2.8: GP -13.8,-23.07; GP2 14.1,-23.07; GP3 11.7,-0.9; GP4 -13.9,-1 | hole 1.1: -11.6,-2.1 | hole 1.6: 9.5,-2.1
USB-MINIB = smd 2.5 x 0.5: D+ 2.5,0; D- 2.5,0.8; GND 2.5,-1.6; ID 2.5,-0.8; VBUS 2.5,1.6 | smd 2.5 x 2: MTN1 -3,4.5; MTN2 2.5,4.5; MTN3 -3,-4.5; MTN4 2.5,-4.5 | hole 0.9: 0,2.2; 0,-2.2
SOT363_PHILIPS = smd 0.4 x 0.9: 1 -0.65,-1.05; 2 0,-1.05; 3 0.65,-1.05; 4 0.65,1.05; 5 0,1.05; 6 -0.65,1.05
CRYSTAL_8X3.8 = smd 1.3 x 1.9: P$1 -2.75,-1.6; P$2 2.75,-1.6; P$3 2.75,1.6; P$4 -2.75,1.6
RESONATOR_EPSON_FC_145 = smd 1.1 x 1.8: P$1 -1.55,0; P$2 1.55,0
CT/CN0603 = smd 1 x 1: 1 -1,0; 2 1,0

### Placement (x,y rotation side)
AD  57.15,2.54 0 top
ANT1  4.7,44.58 180 top
ANT2  4.57,37.34 180 top
B1  7.11,42.67 270 bottom
C1  29.88,25.93 270 top
C2  52.56,13.95 90 top
C3  50.2,43.03 0 top
C4  39.84,43.43 90 top
C5  41.59,44.47 90 top
C6  43.05,14.1 270 top
C7  54.99,14.22 270 top
C8  43.18,25.53 270 top
C9  37.08,14.22 270 top
C16  25.8,11.83 270 top
C19  46.08,23.75 180 top
C20  42.99,32.4 90 top
C21  55.72,34.86 180 top
C23  53.72,27.69 90 top
C24  55.63,27.69 90 top
C26  9.07,29.62 180 top
C27  25.79,26.75 270 top
C35  20.81,26.75 270 top
CAGND  28.83,36.96 90 top
CDC2  25.65,42.55 180 top
CDEC  28.83,32.51 270 top
CDIV1  16,35.31 270 top
CDIV2  14.1,31.5 180 top
CFCAP  28.83,42.16 90 top
CN2  64.9,18 0 top
CRES  18.54,35.31 90 top
D1  12.9,12.13 180 top
D2  31.08,5.82 0 top
F2  14.43,28.23 180 top
FD1  13.84,48.26 180 top
FD2  2.18,9.11 0 top
FD3  66.06,38.51 0 top
IC1  21.41,17.29 270 top
IC2  48.97,35.99 180 top
IC3  33.66,14.1 90 top
IC4  49.91,13.97 90 top
IC5  35.18,41.66 0 top
IC6  24,36.45 270 top
ICSP  64.9,27.94 270 top
IOH  30.23,50.8 180 top
IOL  54.61,50.8 180 top
L5  21.47,13.31 270 top
L6  58.35,31.98 270 top
L7  6.27,30.48 90 top
LED1  8,51.05 0 top
PC1  39.5,19.33 270 top
PC2  51.46,8.27 180 top
POWER  36.83,2.54 0 top
R1  29.82,8.11 180 top
R2  41.53,25.53 270 top
R3  51.56,23.62 180 top
R4  50.67,25.27 0 top
R6  9.91,51.05 270 top
R7  18.67,40.39 270 top
R9  30.99,42.29 270 top
R10  20.78,19.95 0 top
R11  20.78,21.46 0 top
R12  31.75,45.47 270 top
R13  29.21,45.85 270 top
R14  28.21,25.97 90 top
R28  36.47,10.82 0 top
R29  32.46,10.41 90 top
R30  29.36,13.48 270 top
R31  29.97,11.13 0 top
R34  17.46,18.36 270 top
R35  49.02,17.14 0 top
R36  46.74,13.21 270 top
R37  46.74,16.13 270 top
R39  12.5,9.14 180 top
R40  15.63,9.14 180 top
RESET  21.34,3.68 0 top
SJ1  10.79,34.92 270 top
SJ2  11.68,38.86 0 top
TP_0  63.5,50.8 0 top
TP_1  60.96,50.8 0 top
TP_2  58.42,50.8 0 top
TP_3  55.88,50.8 0 top
TP_3V3  35.56,2.54 0 top
TP_4  53.34,50.8 0 top
TP_5  50.8,50.8 0 top
TP_5V  38.1,2.54 0 top
TP_6  48.26,50.8 0 top
TP_7  45.72,50.8 0 top
TP_8  41.66,50.8 0 top
TP_9  39.12,50.8 0 top
TP_10  36.58,50.8 0 top
TP_12  31.5,50.8 0 top
TP_A0  50.8,2.54 0 top
TP_A1  53.34,2.54 0 top
TP_A2  55.88,2.54 0 top
TP_A3  58.42,2.54 0 top
TP_A4  60.96,2.54 0 top
TP_AREF  23.88,50.8 0 top
TP_MOSI  34.04,50.8 0 top
TP_RESET  33.02,2.54 0 top
TP_SCK  28.96,50.8 0 top
TP_SCL  18.8,50.8 0 top
TP_SDA  21.34,50.8 0 top
TR1  13.72,16.82 180 top
TVS1  19.25,10.73 270 top
U$1  -9.02,-22.61 0 top  (outside the outline)
U$2  -9.53,-43.56 0 top  (outside the outline)
U$3  6.84,4.65 0 top
U$4  25.4,18.03 90 bottom
U$5  6.22,22.73 0 top
U$6  4.83,13.84 180 top
U$7  13.84,44.96 270 top
U$8  13.84,42.29 270 top
Y1  33.53,33.15 270 top
Y4  54.61,30.48 0 top
Z5  14.73,21.42 0 top
Z6  14.73,24.68 0 top

### Tracks (layer width: path | path; a pad name or v marks a point on that pad's centre or on a via)
2GND
  Top 0.813: U$5.MTN4 9.03,18.16 8.89,18.16 8.82,18.23 U$5.MTN3 U$5.MTN1 6.22,27.23 | 6.22,27.23 U$5.MTN2 | L7.1 6.22,29.33 6.22,27.23
  pour Top: 1.78,28.57 10.41,28.57 10.41,25.65 7.87,25.65 7.87,19.68 10.41,19.68 10.41,16.76 1.78,16.76
+3V3  (via drill 0.61, 0.81)
  Top 0.127: 49.71,31.73 IC2.44
  Top 0.203: 50.26,15.84 IC4.6 | IC4.5 50.91,16.11 51.05,16.13 | IC4.12 48.46,13.31
  Top 0.254: 49.72,32.55 IC2.44 49.72,27.15 48.13,25.57 48.13,22.86 v49.66,21.34 50.42,20.57 51.44,20.57 52.07,19.94 52.07,16.38 52.32,16.12 | IC2.17 49.72,40.58 49.73,40.59 49.73,41.1 50.96,42.33 C3.2 | 48.46,13.31 48.34,13.18
  Top 0.305: 50.96,42.31 C3.2 | 50.8,16.13 50.55,16.13 | C2.2 52.3,14.72 | IC2.36 | R13.2 27.97,44.96 27.32,45.61 U$7.6 | IC2.17 49.72,38.8 47.5,36.58 47.5,35.05 49.34,33.21 49.72,33.24 | 49.72,33.24 49.72,32.55 | IC2.36 49.72,33.24 | IC5.8 33.27,44.58 R12.2 | IC2.36 44.58,33.24 v44.58,32 44.09,31.52 C20.1 | U$8.6 14.34,42.94 13.84,43.43 13.84,45.59 | U$7.6 14.88,45.59 | 13.84,45.59 14.89,45.59 U$7.6 | LED1.A 10.13,47.88 11.43,47.88 12.83,46.48 13.46,46.48 13.84,46.1 13.84,45.59
  Top 0.406: IC4.14 52.3,14.72 | 50.26,15.84 50.55,16.13 | 48.34,13.18 47.88,12.7 47.5,12.32 R36.2 46.74,10.16 46.86,10.03 46.74,9.91 | C20.1 42.97,31.5 | 52.32,16.12 52.56,16.12 | 29.08,44.83 R13.2 29.21,44.58 29.84,43.94 29.84,42.16 30.61,41.4 R9.2 | R12.2 32,44.32 32,41.91 31.5,41.4 R9.2 | R10.2 22.26,19.35 IC1.5 23.4,17.94 v23.75,18.29 | v31.75,26.16 31.11,26.16 30.46,26.82 C1.1 30.1,27.05 30.1,36.58 31.37,37.85 31.62,37.85 32.26,38.48 32.26,39.88 31.75,40.39 31.37,40.39 30.99,40.77 R9.2 | L6.2 58.35,25.2 v57.4,24.26
  Top 0.61: POWER.2 30.55,2.61 30.55,3.23 29.38,4.4 D2.C 28.93,6.27 R1.2 28.28,8.76 v22.73,8.76
  Top 0.813: 50.8,16.13 51.05,16.13 52.45,16.13 52.56,16.12 | TP_3V3.X 35.56,4.19 39.88,8.51 45.34,8.51 46.74,9.91 48.9,9.91 | C2.2 52.56,16.12 | 52.56,16.12 54.49,16.12 C7.+ | 48.9,9.91 56.26,9.91 57.53,11.3 | PC2.+ 48.9,8.44 48.9,9.91
  Top 1.016: C7.+ 55.25,15.5 55.63,15.88 56.97,15.88 57.53,15.31 v57.53,14.02 57.53,11.3
  Bottom 0.254: TP_3V3.X
  Bottom 0.406: v57.53,14.02 58.47,14.02 62.99,18.54 62.99,19.68 63.85,20.54 CN2.1 | v31.75,26.16 33.78,24.13 37.47,24.13 44.58,31.11 v44.58,32 | v57.4,24.26 56.9,23.75 52.2,23.75 49.78,21.34 v49.66,21.34
  Bottom 0.61: TP_3V3.X 35.56,3.56 34.8,4.32 31.37,4.32 30.55,3.5 30.55,2.61 POWER.2 | 26.27,17.4 U$4.4 24.6,17.43 v23.75,18.29 23.37,18.29 21.34,16.26 21.34,10.16 v22.73,8.76
  Bottom 0.813: TP_3V3.X
+5V  (via drill 0.61, 0.81)
  Top 0.203: IC4.7 49.61,15.96
  Top 0.254: IC3.9 34.05,15.22 34.16,15.11 34.89,15.11 | 34.89,15.11 IC3.20 | 34.89,15.11 34.92,15.15 34.92,16.64
  Top 0.305: 42.66,15.36 42.81,15.36 C6.+
  Top 0.406: TP_5V.X | R35.2 49.61,16.84 49.61,15.96 | ICSP.2 67.82,28.83 67.82,24.51 66.55,23.24 64.77,23.24 v62.36,20.83 | TR1.2 15.55,15.8 16,16.26 v16.76,16.26 | 17.22,17.47 R34.2 | R28.2 37.45,10.73 v38.67,10.73
  Top 0.61: 23.5,33.27 IC6.7 | IC6.4 22.73,37.08 23.5,36.32 23.5,33.27 | 23.5,33.27 v23.62,33.27 | v16.76,16.26 17.46,16.95 R34.2
  Top 0.813: v41.27,6.86 38.1,3.68 TP_5V.X | 42.66,15.36 41.91,15.37 v40.48,13.96 39.5,14.95 39.5,16.64 | C6.+ 43.81,16.26 43.81,17.65 45.21,19.05 v49.91,19.05 R35.2 | v23.62,20.19 25.27,20.19 28.83,16.64 34.92,16.64 37.08,16.64 | R34.2 | 37.08,16.64 39.5,16.64 | 39.5,16.64 PC1.+ | C9.1 37.08,16.64
  Bottom 0.406: TP_5V.X | v62.36,20.83 60.58,19.05 v49.91,19.05
  Bottom 0.61: v23.62,33.27 22.86,33.27 13.97,26.16 13.97,17.27 14.99,16.26 v16.76,16.26
  Bottom 0.813: v40.48,13.96 40.48,12.6 v38.67,10.73 38.61,9.53 v41.27,6.86 | v23.62,20.19 21.72,20.19 21.08,19.43 21.08,17.78 19.56,16.26 v16.76,16.26
  pour Top (no thermals): 34.29,14.99 44.45,14.99 44.45,19.05 34.29,19.05
DGI_GPIO2_PA6  (via drill 0.61)
  Top 0.254: IC2.11 55.64,38.24 56.52,39.12 v56.52,39.75
  Bottom 0.254: v56.52,39.75 56.52,39.88 47.62,48.77 43.69,48.77 TP_8.X
DGI_GPIO3_PA7  (via drill 0.61)
  Top 0.254: IC2.12 53.85,38.74 v54.86,39.75
  Top 0.406: U$8.4 15.88,41.64 15.88,43.56 | 15.88,43.56 15.88,44.31 U$7.4 | v17.14,43.69 16,43.69 15.88,43.56
  Bottom 0.254: v54.86,39.75 54.86,40.77 47.37,48.26 43.43,48.26 42.42,49.28 40.64,49.28 TP_9.X
  Bottom 0.305: TP_9.X 37.34,52.58 23.5,52.58 22.61,51.69 22.61,49.15 v17.14,43.69
GND  (via drill 0.61, 0.81)  (2 unrouted)
  Top 0.203: 47.7,13.77 IC4.11 47.81,13.77 47.37,13.34 | 49.23,13.39 49.23,13.11
  Top 0.254: IC2.18 49.22,42.51 | IC2.42 48.72,28.15 45.21,24.64 | 30.99,14.86 30.56,14.86 IC3.14 IC3.13 31.91,15.35 IC3.12 32.1,14.76 33.41,13.46 IC3.3 33.41,11.81 36.07,11.81 37.08,12.83 C9.2 38.89,13.34 39.62,12.6 C6.- 43.79,12.6 | 54.17,26.97 C23.1 C24.1 | IC2.5 54.45,35.24 C21.2 54.83,34.32 55.82,33.34 v56.4,33.34 | 45.21,24.64 C8.2 | C19.2 45.19,24.62 45.21,24.64 | IC4.2 IC4.1 49.21,13.65 | IC4.11 49.09,13.77 49.21,13.65 | 51.68,13.95 49.5,13.95 49.21,13.65 | 47.37,13.34 47.24,13.21 46.1,13.21
  Top 0.305: POWER.6 POWER.7 | 49.22,42.51 49.23,42.26 | IC2.35 43.44,33.74 C20.2 | 46.1,13.21 44.4,13.21 43.79,12.6
  Top 0.406: R29.1 29.59,9.52 29.08,10.04 29.08,10.16 | 29.08,10.16 R31.1 | C16.- 25.98,10.16 29.08,10.16 | 51.68,13.95 C2.1 | IC1.3 19.94,16.64 19.07,17.5 v19.07,18.16 | v17.68,21.46 17.64,21.42 Z5.2 | v18.31,24.51 18.1,24.68 Z6.2
  Top 0.61: C27.- C35.- | 19.3,10.82 17.55,10.82 R40.1 | 19.3,10.82 v23.09,10.82 23.62,10.31 C16.- | U$5.GND 9.98,21.13 11.18,19.94 11.18,16.38 10.14,15.34 U$6.P$3 | IC6.5 20.32,35.81 19.81,35.31 14.73,35.31 14.1,34.67 14.1,33.4 12.6,31.9 CDIV2.2 12.51,31.58 8.18,31.58 | 8.18,31.58 L7.2 | C26.2 8.18,31.58 | TVS1.A 19.3,12.63 19.3,10.82
  Top 0.813: U$6.P$4 5.18,15.34 v5.22,15.3 8.17,15.3 U$6.P$3
  Bottom 0.61: U$4.6 24.37,12.43 23.09,11.15 v23.09,10.82
  other vias: 57.91,38.86 17.14,49.02 48.26,2.54 63.6,42.95 49.36,44.53 62.96,11.11 17.75,30.76 3.96,40.01 46.25,20.95 3.15,51.08 24.1,46.76 29.74,48.13 29.44,19.46 39.78,46.1 14.58,6.12 49.42,11.37 45.1,7.05 33.5,8.15 55.6,24.92 38.84,34.32 20.6,44.07 21.49,30.35 41.17,31.24 1.63,1.68 59.91,5.27 57.11,17.72 49.24,23.68 37.05,34.99 22.95,15.05 21.43,7.56 12.09,21.59 12.09,24.64 1.04,29.84 40.61,10.82 45.31,11.07 5.04,10.1 32.87,20.09
  pour Bottom (isolate 0.254, rank 2): -4.61,55.5 71.12,55.88 70.48,-1.65 -5.06,-1.14
  pour Top (isolate 0.305, rank 2): -3.81,54.46 70.16,55.24 72.44,-2.16 -3.94,-2.79
N$1  (1 unrouted)
  Top 0.305: 9.87,51.94 8.16,51.94 LED1.C
N$2
  Top 0.406: Y1.P$4 35.13,37.13 34.54,37.72 IC5.2
N$3
  Top 0.406: Y1.P$1 32.05,36.37 33.27,37.59 IC5.1
N$4
  Top 0.406: IC6.15 28.8,39.62 CFCAP.1
N$5
  Top 0.406: IC6.11 28.8,34.54 CAGND.1
N$6
  Top 0.406: R34.1 12.55,19.25 12.55,15.98 TR1.3 13.79,14.73 | R40.2 R39.1 12.95,9.58 12.95,13.89 13.79,14.73 | 13.79,14.73 16.38,14.73 16.76,15.11 17.27,15.11 17.91,15.75 20.7,15.75 20.95,16 22.1,16 22.26,16.16 IC1.4
N$7
  Top 0.305: U$5.ID 10.2,21.93 11.94,20.19 18.16,20.19 19.43,21.46 R11.1
  Top 0.406: R11.1 R10.1 19.89,19.1 20.56,18.43 IC1.1 IC1.2
N$8
  Top 0.406: D1.C 15.18,12.13 17.27,14.22 17.65,14.22 18.03,14.61 21.28,14.61 L5.1
N$9
  Top 0.203: IC4.9 48.46,15.04 48.39,15.11
  Top 0.406: 48.39,15.11 48.39,16 R35.1
N$10
  Top 0.254: IC2.6 55.95,35.74 56.74,34.96 C21.1
  Top 0.305: C21.1 57.2,34.86 58.04,34.04 58.35,33.73 L6.1
N$11
  Top 0.203: IC4.10 47.88,14.17 47.83,14.22
  Top 0.254: 47.83,14.22 47.68,14.33 46.97,14.33 R36.1
  Top 0.406: R37.2 R36.1
N$12
  Top 0.406: IC6.6 20.32,34.54 18.67,34.16 17.25,34.16 CRES.1
N$13
  Top 0.61: IC6.8 16.11,32 CDIV2.1 16,31.9 CDIV1.2
N$14  (1 unrouted)
  Top 0.406: U$7.3 6.33,44.31 1.57,39.55 ANT2.P$4
  Top 0.61: SJ2.1 9.88,38.84 ANT2.P$3
N$16
  Top 0.305: 14.35,42.29 U$8.5
  Top 0.406: 14.35,42.29 13.84,41.78 13.84,41.15 16,38.99 CDIV1.1
  Top 0.61: SJ1.2 11.43,33.66 14.58,36.81 CDIV1.1 CRES.2
N$17
  Top 0.406: CDC2.1 26.52,42.38 IC6.16
N$18
  Top 0.406: IC6.9 28.45,32 CDEC.2
N$19
  Top 0.406: IC6.10 28.7,33.27 CDEC.1
N$20
  Top 0.61: IC6.3 20.07,38.35 19.18,39.24 R7.2
N$21  (1 unrouted)
  Top 0.406: 1.68,35.84 ANT2.P$2 1.57,35.86 6.22,40.51 9.27,40.51 9.91,41.15 11.43,41.15 11.92,41.64 U$8.3 | ANT2.P$1 7.93,36.2 SJ1.1
N$22  (via drill 0.61)
  Top 0.406: R7.1 18.67,44.07 17.78,44.96 U$7.5
  Top 0.61: v14.48,38.86 SJ2.2 | v16.64,40.39 16.89,40.64 16.89,40.89 17.8,41.81 R7.1
  Bottom 0.61: v16.64,40.39 15.11,38.86 v14.48,38.86
N$24  (1 unrouted)
  Top 0.406: U$8.1 7.7,42.94 ANT1.P$1
N$25  (1 unrouted)
  Top 0.406: U$7.1 7.7,45.61 ANT1.P$3
N$26
  Top 0.254: 35.3,10.79 R28.1 35.48,10.92 33.27,10.92 32.9,11.3 R29.2 32.46,11.73 32.1,12.09 IC3.1
N$28
  Top 0.254: IC3.17 30.62,13.35 29.87,12.6 R30.2
N$29
  Top 0.254: R31.2 30.88,12.59 31.13,12.85 IC3.18
PA00_XIN32
  Top 0.254: IC2.1 53.26,33.23 53.26,30.8 Y4.P$1 53.06,29.24 C23.2
PA01_XOUT32
  Top 0.254: IC2.2 53.76,33.74 56.23,31.27 Y4.P$2 56.16,29.11 C24.2
PA02_AIN0
  Top 0.254: IC2.3 54.02,34.24 56.26,32 59.31,32 59.31,9.65 54.36,4.7 52.7,4.7 50.8,2.79 TP_A0.X
PA03_AREFA  (via drill 0.61)
  Top 0.254: C5.+ 39.77,42.47 C4.1 39.12,42.41 38.61,42.93 38.61,44.83 35.05,48.39 32.13,48.39 31.24,49.28 25.4,49.28 TP_AREF.X
  Top 0.305: v40.64,40.89 39.84,41.69 C4.1 | IC2.4 52.38,34.74 52.07,35.05 52.07,37.19 v51.33,37.92
  Bottom 0.305: TP_AREF.X 23.92,50.76
  Bottom 0.406: v40.64,40.89 42.55,40.89 42.99,40.96 48.81,40.96 v51.33,37.92
PA04_AIN4
  Top 0.254: IC2.9 59.28,37.24 60.83,35.69 60.83,8.51 58.42,6.1 TP_A3.X
  Top 0.305: TP_A3.X 58.37,2.59
PA05_AIN5
  Top 0.254: IC2.10 59.54,37.74 61.34,35.94 61.34,2.92 AD.5
PA08_TCC0-W0_PA8
  Top 0.254: IC2.13 51.82,40.27 54.99,43.43 54.99,48.64 55.63,49.28 56.9,49.28 TP_2.X
PA09_TCC0-W1_PA9
  Top 0.254: IC2.14 51.22,40.81 51.44,41.02 51.82,41.02 54.36,43.56 54.36,48.9 55.88,50.42 TP_3.X
PA10_MISO
  Top 0.254: IC2.28 43.66,37.24 42.67,38.23 42.67,39.75 43.05,40.13 43.05,46.61 42.04,47.62 39.62,47.62 39.24,47.24 36.96,47.24 35.31,48.9 32.64,48.9 31.5,50.04 TP_12.X
  Bottom 0.254: TP_12.X 31.48,50.81
  Bottom 0.305: 31.48,50.81 31.46,50.79
PA10_TCC0-W2_PA10
  Top 0.254: IC2.15 50.72,41.07 51.31,41.66 51.69,41.66 53.85,43.81 53.85,49.15 54.61,49.91 54.61,51.44 55.5,52.32 59.44,52.32 TP_1.X
  Bottom 0.305: 60.91,50.74 TP_1.X
PA11_TCC0-W3_PA11
  Top 0.254: IC2.16 50.22,39.44 50.55,39.12 51.94,39.12 52.58,39.75 52.58,40.26 55.63,43.31 55.63,48.39 56.01,48.77 57.28,48.77 57.78,49.28 61.98,49.28 TP_0.X
  Bottom 0.305: 63.57,50.73 TP_0.X
PA13
  Top 0.254: IC2.22 47.22,39.6 46.86,39.24 46.1,39.24 45.72,39.62 IOL.8
PA14_TCC0-W4
  Top 0.254: IC2.23 46.72,45.96 49.91,49.15 51.69,49.15 TP_4.X
PA15_TCC0-W5
  Top 0.254: IC2.24 46.2,40.28 46.2,46.2 TP_5.X
PA16_MOSI
  Top 0.305: IC2.25 44.7,47.38 42.93,49.15 42.93,51.44 41.78,52.58 34.04,52.58 TP_MOSI.X
PA17_SCK  (via drill 0.61)
  Top 0.254: IC2.26 44.69,38.23 | 44.68,38.23 IC2.26 | v37.97,48.77 38.1,48.9 42.29,48.9 44.07,47.12 44.07,39.5 43.69,39.12 43.69,38.73 44.18,38.24 IC2.26
  Bottom 0.254: v37.97,48.77 30.99,48.77 TP_SCK.X
PA18_SS
  Top 0.254: IC2.27 43.92,37.74 43.18,38.48 43.18,39.5 43.56,39.88 43.56,46.86 42.16,48.26 39.37,48.26 38.86,47.75 37.34,47.75 36.58,48.51 TP_10.X
  Bottom 0.254: 36.53,50.75 TP_10.X
PA20_TCC0-W6
  Top 0.254: IC2.29 44.71,36.73 45.44,36.73 45.72,37.01 45.72,38.86 45.21,39.37 45.21,47.62 44.45,48.39 44.45,51.56 45.34,52.45 46.61,52.45 TP_6.X
PA21_RTC_INT  (via drill 0.61)
  Top 0.254: IC2.30
  Top 0.305: IC2.30 43.77,36.24 v41.4,38.61 | v38.61,36.58 37.97,37.21 37.97,40.39 36.7,41.66 36.2,41.66 34.54,43.31 IC5.7 34.54,45.85 32.77,45.85 32.38,45.47 31.11,45.47 30.73,45.09 30.73,43.43 R9.1 30.86,43.18
  Bottom 0.305: v41.4,38.61 40.64,38.61 v38.61,36.58
PA22_SDA
  Top 0.305: 43.63,35.74 IC2.31 43.38,35.74 41.78,37.34 40.64,37.34 39.24,38.73 39.24,41.02 37.08,43.18 IC5.5 37.08,45.59 35.43,47.24 30.73,47.24 30.23,46.74 R13.1 28.32,46.74 26.42,48.64 23.5,48.64 TP_SDA.X
PA23_SCL
  Top 0.305: IC2.32 42.99,35.24 41.53,36.7 40.39,36.7 38.61,38.48 38.61,40.77 36.96,42.42 36.32,42.42 35.81,42.93 IC5.6 35.81,45.72 35.05,46.48 31.88,46.48 R12.1 30.61,46.35 30.1,45.85 28.19,45.85 26.16,47.88 21.72,47.88 TP_SCL.X
PA27_TX_LED  (via drill 0.61)
  Top 0.305: v36.96,25.4 38.61,25.4 40.89,27.69 45.34,27.69 47.22,29.57 IC2.39 | R6.2 v11.68,50.16
  Bottom 0.305: v36.96,25.4 34.67,27.43 30.61,27.43 24.89,33.15 24.89,35.05 18.41,41.53 16.13,41.53 14.48,43.18 14.48,44.96 11.68,47.75 v11.68,50.16
PA28_USB_HOST_EN
  Top 0.305: IC2.41 48.22,28.66 45.09,25.53 40.26,25.53 36.45,21.72 21.97,21.72 R11.2
PA30_SWCLK
  Top 0.254: IC2.45 50.22,26.6 49.78,26.16 R4.1
PA31_SWDIO
  Top 0.254: IC2.46 50.72,23.67 R3.2
PB02_CS_SD  (via drill 0.61)
  Top 0.254: IC2.47 51.22,27.39 58.8,19.81 58.8,10.03 54.1,5.33 51.56,5.33
  Top 0.305: 51.56,5.33 44.45,5.33 v43.43,6.35
  Bottom 0.305: U$4.1 25.44,24.93 24.13,23.62 24.13,21.21 30.99,21.21 30.99,16.13 24.13,16.13 24.13,13.72 32.26,13.72 40.39,5.59 42.67,5.59 v43.43,6.35
PB03_RFIDIN  (via drill 0.61)
  Top 0.305: IC2.48 51.72,33.37 v50.42,33.91 | IC6.13 28.07,37.08 28.19,36.96 29.46,36.96 29.97,37.47 29.97,38.1 v30.99,39.12
  Bottom 0.305: v50.42,33.91 48.01,35.69 45.85,37.08 44.7,37.72 42.67,39.75 39.75,39.75 38.61,40.89 32.38,40.89 30.99,39.5 v30.99,39.12
PB08_AIN2
  Top 0.254: IC2.7 58.75,36.24 59.82,35.18 59.82,9.27 53.34,2.79 TP_A1.X
  Top 0.305: TP_A1.X 53.37,2.56
PB09_AIN3
  Top 0.254: IC2.8 59.02,36.74 60.33,35.43 60.33,8.89 55.88,4.45 TP_A2.X
PB10_S4_SPI_MOSI  (via drill 0.61)
  Top 0.305: IC2.19 48.72,39.45 48.26,38.99 47.5,38.99 46.48,37.97 v46.48,34.29
  Bottom 0.305: v46.48,34.29 46.48,32.13 | 46.48,32.13 66.42,32.13 67.44,31.11 67.44,29.21 ICSP.4 | 46.48,32.13 36.7,22.43 U$4.2
PB11_S4_SPI_SCK  (via drill 0.61)
  Top 0.254: IC2.20 48.22,41.26 47.8,41.68 47.8,45.11 48.92,46.23 v52.2,46.23 | v56.39,42.04 62.48,35.94 62.48,29.08 ICSP.3
  Bottom 0.254: v52.2,46.23 v56.39,42.04
  Bottom 0.406: U$4.5 31.19,14.93 36.7,20.45 40.26,20.45 47.75,27.94 ICSP.3
PB12_S4_SPI_MISO  (via drill 0.61)
  Top 0.254: IC2.21 47.72,40.92 47.28,41.36 47.28,45.69 49.34,47.75 v52.2,47.75 | ICSP.1 63.12,30.99 63.12,36.2 57.53,41.78 57.53,43.31 v56.77,44.07
  Bottom 0.254: v52.2,47.75 53.09,47.75 v56.77,44.07
  Bottom 0.305: U$4.7 35.02,9.93 40.13,4.83 44.7,4.83 48.64,8.76 56.9,8.76 61.47,13.34 65.66,13.34 68.07,15.75 68.07,25.53 66.93,26.67 65.66,26.67 64.9,27.43 64.9,29.21 ICSP.1
PB22_RFID_RDY  (via drill 0.61)
  Top 0.305: v39.88,29.34 44.7,29.34 46.22,30.85 IC2.37 | v24.13,39.62 IC6.2
  Bottom 0.305: v39.88,29.34 37.08,29.34 36.45,28.7 31.24,28.7 26.29,33.66 26.29,35.81 25.53,36.58 25.53,38.23 v24.13,39.62
PB23_RFID_SHD  (via drill 0.61)
  Top 0.305: IC2.38 46.72,30.21 45.09,28.57 40.77,28.57 39.5,27.3 v38.61,27.3 | v24.13,37.85 25.02,37.85 25.53,38.35 IC6.14
  Bottom 0.305: v38.61,27.3 37.21,27.3 36.45,28.07 30.86,28.07 25.53,33.4 25.53,35.43 24.13,36.83 v24.13,37.85
PWRIN  (via drill 0.61)
  Top 0.61: R39.2 11.61,8.38 | 11.61,8.38 12.17,7.87 17.65,7.87 17.91,8.13 18.85,8.13 TVS1.K 19.56,8.23 19.56,4.57 v19.81,4.32 | U$3.P$5 10.63,7.4 11.61,8.38
  Top 0.813: U$3.P$5 9.34,10.61 10.16,11.43 10.16,11.59 D1.A
  Bottom 0.406: POWER.8 43.81,0.64 23.5,0.64 v19.81,4.32
PWRIN_1
  Top 0.813: U$6.P$2 U$6.P$1 6.84,12.34 U$3.P$3
RESET  (via drill 0.61)
  Top 0.406: TP_RESET.X 33.02,1.91 31.75,0.64 26.33,0.64 RESET.4 | v42.67,10.41 41.66,9.4 36.36,9.4 D2.A | R2.2 41.53,23.5 42.93,22.1 v42.93,20.7
  Top 0.61: TP_RESET.X 33.02,5.82 D2.A 32.78,6.71 31.39,8.11 R1.1
  Top 0.813: RESET.3 RESET.4
  Bottom 0.406: ICSP.5 63.75,25.27 63.75,24.64 64.52,23.88 65.15,23.88 67.31,21.59 67.31,16.13 66.64,15.46 CN2.10 65.53,15.24 64.39,14.1 60.96,14.1 56.64,9.78 43.56,9.78 42.93,10.41 v42.67,10.41 42.93,10.67 v42.93,20.7
SWCLK  (via drill 0.61)
  Top 0.254: R4.2 52.45,25.27 54.61,23.11 v54.61,21.97
  Bottom 0.305: CN2.4 66.26,19.27 66.67,19.68 66.67,21.34 65.02,22.99 55.75,22.99 v54.61,21.97
SWDIO  (via drill 0.61)
  Top 0.254: R3.1 v52.45,21.97
  Bottom 0.305: CN2.2 65.53,21.34 64.64,22.23 56.9,22.23 55.24,20.57 53.85,20.57 v52.45,21.97
TARGET_RESET
  Top 0.305: R2.1 C8.1 45.09,26.42 47.72,29.05 IC2.40
TARGET_USB_N
  Top 0.254: U$5.D- 9.14,23.5 13.73,23.5 | 13.73,23.5 27.81,23.5 arc55 36.2,27.3 40.39,33.53 arc-54 42.16,34.74 IC2.33 | Z6.1 13.73,23.5
TARGET_USB_P
  Top 0.254: IC2.34 IC2.34 arc90 IC2.34 | 44.62,34.24 IC2.34 | U$5.D+ 13.72,22.73 | 13.72,22.73 27.43,22.73 arc64 37.34,27.81 40.77,32.89 arc-58 43.56,34.24 IC2.34 | Z5.1 13.72,21.44 13.72,22.73
USBVCC  (via drill 0.61, 0.81)
  Top 0.61: R14.2 26.83,28.25 C27.+
  Top 0.813: C35.+ 19.61,28.5 | C35.+ 21.51,28.25 22.48,29.21 24.26,29.21 25.09,28.25 C27.+ | F2.1 17.25,28.25 18.41,28.25 | 18.41,28.25 C35.+ | TR1.1 15.55,17.83 v15.62,17.91 | v18.41,26.41 v18.41,26.42 18.41,28.25
  Bottom 0.813: v15.62,17.91 15.62,23.62 v18.41,26.41
VBAT1  (via drill 0.61)
  Top 0.406: v34.04,42.04 35.81,40.39 IC5.3
  Bottom 0.406: v34.04,42.04 33.66,42.42 16.13,42.42 15.24,43.31 15.24,45.47 12.95,47.75 12.95,50.67 12.06,51.56 7.78,51.56 B1.+$1
VDDCORE
  Top 0.254: IC2.43 49.22,27.76 46.99,25.53 46.99,23.77 C19.1
VIN
  Top 0.254: IC3.16 30.32,13.85
  Top 0.305: 30.32,13.85 30.09,13.85 R30.1
  Top 0.813: R30.1 28.47,14.37 27.43,13.33 C16.+ 25.27,13.21 23.76,13.22 23.25,13.22 22.24,12.21 L5.2
XUSB
  Top 0.406: U$5.VBUS 9.98,24.33 13.11,27.46 F2.2 13.11,29.31 12.45,29.59 9.99,29.59 C26.1

### Text on the board
tPlace: SCK | PA17 | MISO | PA10 | PA23 | PA22 | PA03 | MOSI | PA16 | SS | PA18 | GPIO3 | PA7 | GPIO2 | PA6 | PA13 | PA20 | PA15 | PA14 | PA9 | PA8 | PA10 | 0
tNames: DIGITAL | SCL | SDA | AREF | GND | 1 | IOREF | RESET | 3V3 | 5V | GND | VIN | PA2 | PB08 | PB09 | PB04 | PB05 | NC
bNames: designed by | tinker it
ReferenceLC: ON
214bmp: D:/SmartProjects/Snc/a4_bn_logo2.bmp